# EAGLE schematic ngff-cardem (EAGLE 7.7.0)
DISCLAIMER: proprietary + confidential; VERSION: v2
Assembly variants: LEDs bott, LEDs top

## Sheet 1 of 3
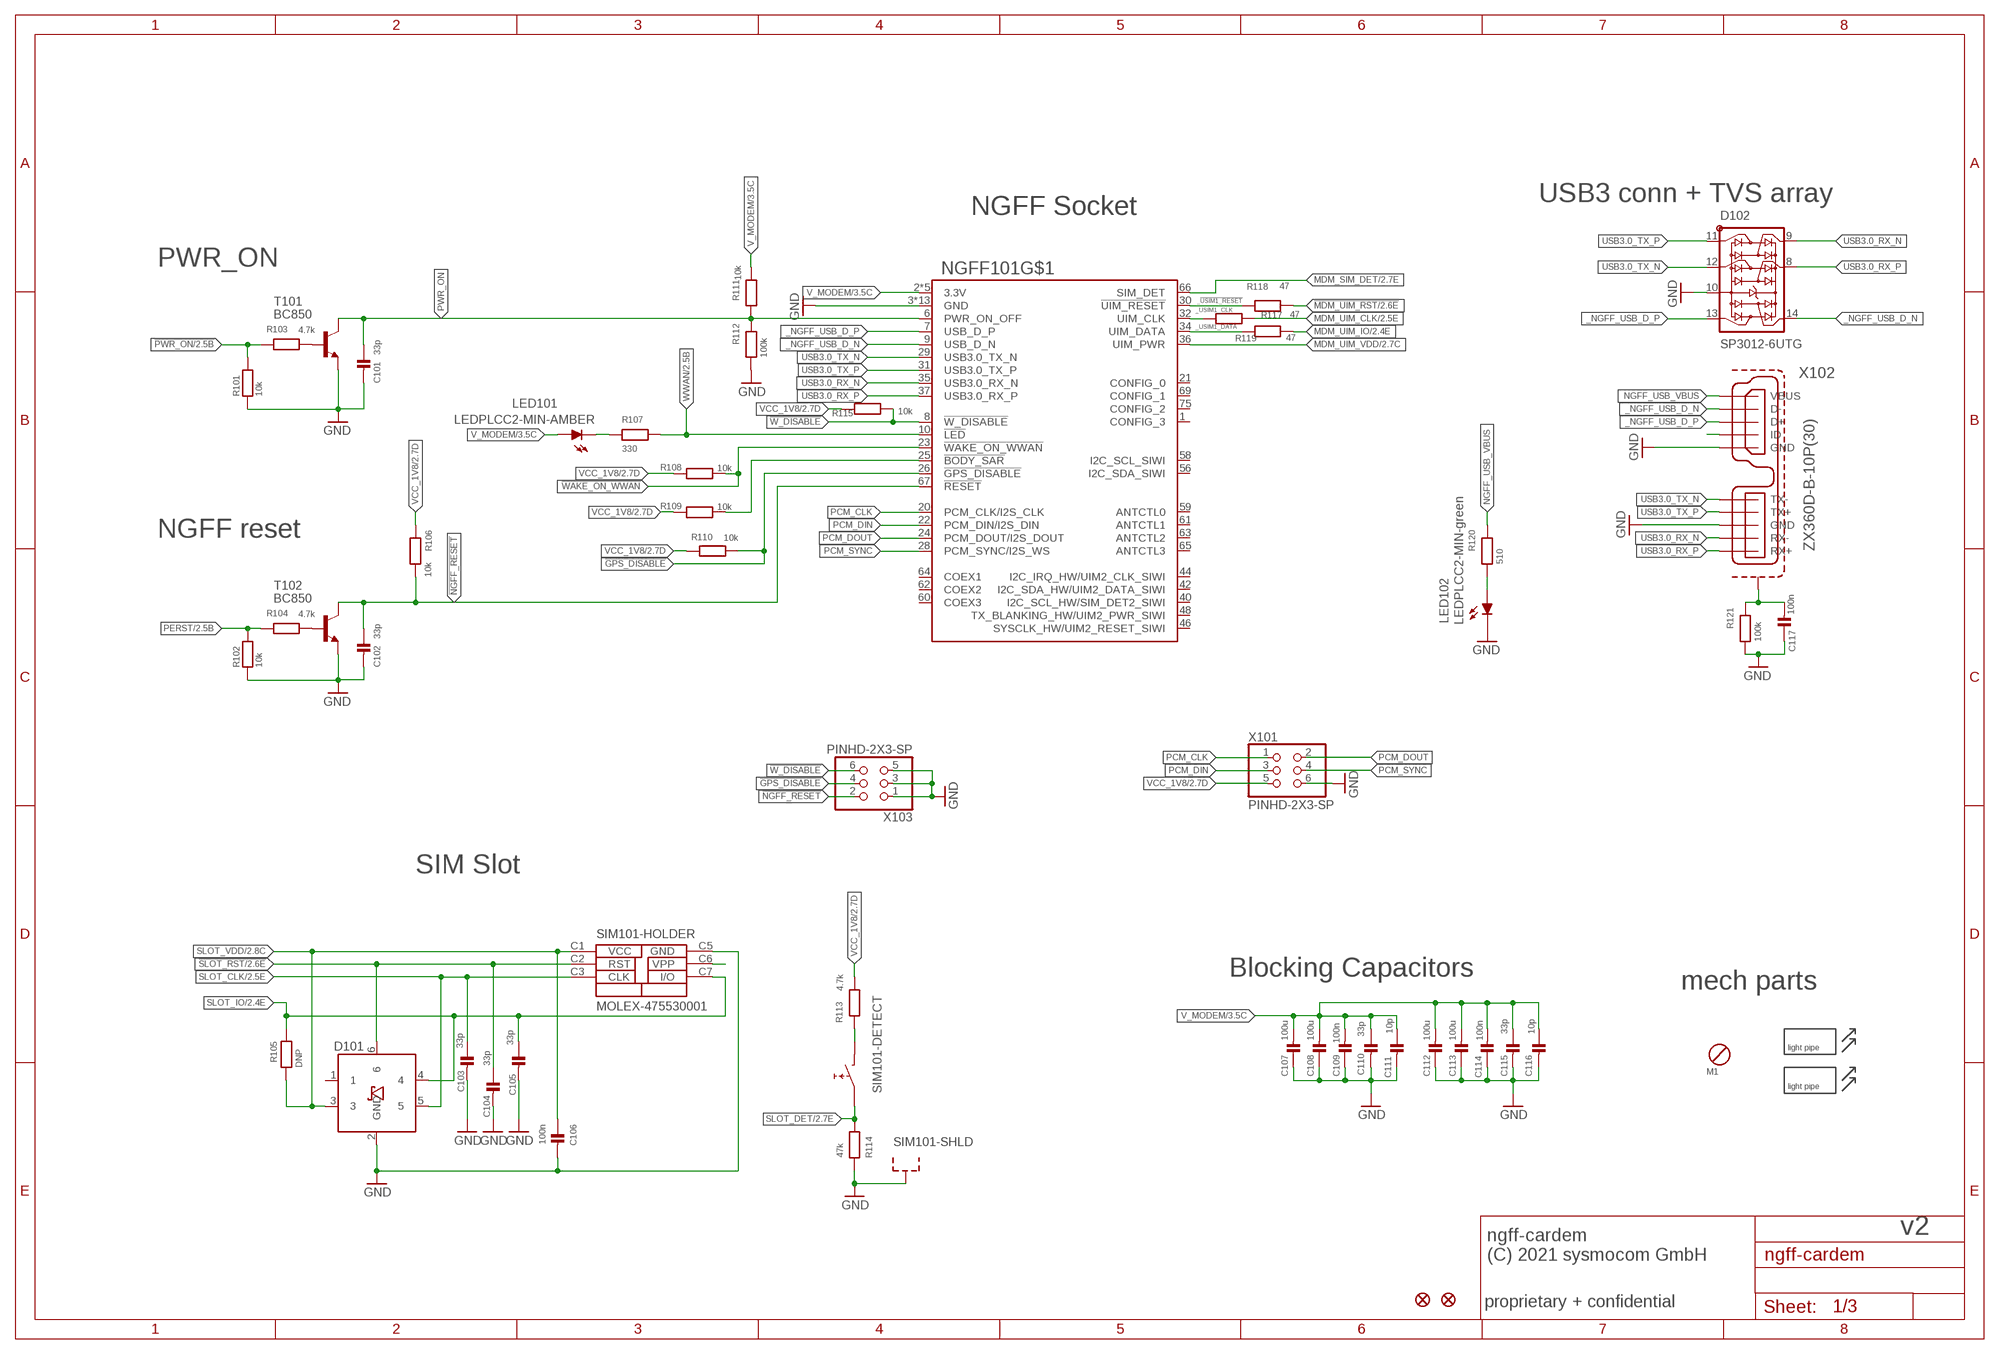
[diagram p0: schematic, sheet 1]
M1 (MECHPART): CLASS: UNKNOWN CLASS; DESCRIPTION: NO DESCRIPTION; LINK: https://www.digikey.de/product-detail/de/jae-electronics/SM3ZS067U410-NUT1-R1200/670-2865-1-ND; MANUFACTURER: UNKNOWN MANUFACTURER; MANUFACTURERPARTNUMBER: UNKNOWN MANUFACTURER PART NUMBER; POPULATED: TRUE; ROHSCERTIFICATE: UNKNOWN ROHS CERTIFICATE; SOURCE: UNKNOWN SOURCE; SOURCEPARTNUMBER: UNKNOWN SOURCE PART NUMBER

### Parts
C101  33p  CAP_CERAMIC_0402  [_0402]
C102  33p  CAP_CERAMIC_0402  [_0402]
C103  33p  CAP_CERAMIC_0402  [_0402]
C104  33p  CAP_CERAMIC_0402  [_0402]
C105  33p  CAP_CERAMIC_0402  [_0402]
C106  100n  CAP_CERAMIC_0603  [_0603]
C107  100u  CAP_CERAMIC1206  [1206]
C108  100u  CAP_CERAMIC1206  [1206]
C109  100n  CAP_CERAMIC_0603  [_0603]
C110  33p  CAP_CERAMIC_0402  [_0402]
C111  10p  CAP_CERAMIC_0603  [_0603]
C112  100u  CAP_CERAMIC1206  [1206]
C113  100u  CAP_CERAMIC1206  [1206]
C114  100n  CAP_CERAMIC_0603  [_0603]
C115  33p  CAP_CERAMIC_0402  [_0402]
C116  10p  CAP_CERAMIC_0603  [_0603]
C117  100n  CAP_CERAMIC_0603  [_0603]
D101  PESD5V0UBV  [SOT666]
D102  SP3012-6UTG  [UDFN-14]
JP102  FIDUCIALUFIDUCIAL  [MICRO-FIDUCIAL]
JP103  FIDUCIALUFIDUCIAL  [MICRO-FIDUCIAL]
LED101  LEDPLCC2-MIN-AMBER  LEDPLCC2-MIN  [PLCC2-MIN]  (not fitted in variant LEDs bott)
LED102  LEDPLCC2-MIN-green  LEDPLCC2-MIN  [PLCC2-MIN]  (not fitted in variant LEDs bott)
M2  MENTOR_12701001  [1270.1001]
M3  MENTOR_12701001  [1270.1001]
NGFF101  NGFF_B-NSOL  [NGFF_3042_3052_NSOL]
R101  10k  RESISTOR_0603  [_0603]
R102  10k  RESISTOR_0603  [_0603]
R103  4.7k  RESISTOR_0603  [_0603]
R104  4.7k  RESISTOR_0603  [_0603]
R105  DNP  RESISTOR_0603  [_0603]
R106  10k  RESISTOR_0603  [_0603]
R107  330  RESISTOR_0603  [_0603]
R108  10k  RESISTOR_0603  [_0603]
R109  10k  RESISTOR_0603  [_0603]
R110  10k  RESISTOR_0603  [_0603]
R111  10k  RESISTOR_0603  [_0603]
R112  100k  RESISTOR_0603  [_0603]
R113  4.7k  RESISTOR_0603  [_0603]
R114  47k  RESISTOR_0603  [_0603]
R115  10k  RESISTOR_0603  [_0603]
R117  47  RESISTOR_0402  [_0402]
R118  47  RESISTOR_0402  [_0402]
R119  47  RESISTOR_0402  [_0402]
R120  510  RESISTOR_0603  [_0603]
R121  100k  RESISTOR_0603  [_0603]
SIM101  MOLEX-475530001  [MOLEX-475530001]
T101  BC850  BC847C-NPN-SOT23-BEC  [SOT23-BEC]
T102  BC850  BC847C-NPN-SOT23-BEC  [SOT23-BEC]
X101  PINHD-2X3-SP  PINHD-2X3  [2X03]
X102  ZX360D-B-10P(30)  USB3.0-MICROB  [ZX360D-B]
X103  PINHD-2X3-SP  PINHD-2X3  [2X03]

### Nets
!BODY_SAR: NGFF101.25(!BODY_SAR) R109.1
!GPS_DISABLE: NGFF101.26(!GPS_DISABLE) R110.1 X103.4
!MDM_UIM_RST: R118.2 ; also sheet 2
!NGFF_RESET: C102.1 NGFF101.67(!RESET) R106.1 T102.C X103.2
!PWR_ON: R101.1 R103.2 ; also sheet 2
!SLOT_RST: C104.1 D101.6 SIM101.C2(-HOLDER:RST) ; also sheet 2
!W_DISABLE: NGFF101.8(!W_DISABLE) R115.1 X103.6
!WAKE_ON_WWAN: NGFF101.23(!WAKE_ON_WWAN) R108.1
_!USIM1_RESET: NGFF101.30(!UIM_RESET) R118.1
_NGFF_USB_D_N [usb]: D102.14 NGFF101.9(USB_D_N) X102.2(D-)
_NGFF_USB_D_P [usb]: D102.13 NGFF101.7(USB_D_P) X102.3(D+)
_USIM1_CLK: NGFF101.32(UIM_CLK) R117.1
_USIM1_DATA: NGFF101.34(UIM_DATA) R119.1
GND [supply-poly]: C101.2 C102.2 C103.2 C104.2 C105.2 C106.2 C107.1 C108.1 C109.1 C110.2 C111.2 C112.1 C113.1 C114.1 C115.2 C116.2 C117.1 D101.2(GND) D102.10(GND) LED102.K(C) NGFF101.3(GND) NGFF101.5(GND) NGFF101.11(GND) NGFF101.27(GND) NGFF101.33(GND) NGFF101.39(GND) NGFF101.45(GND) NGFF101.51(GND) NGFF101.57(GND) NGFF101.71(GND) NGFF101.73(GND) NGFF101.P$1(GND) NGFF101.P$2(GND) R101.2 R102.2 R112.1 R114.1 R121.1 SIM101.C5(-HOLDER:GND) SIM101.S1(-SHLD:SHLD) SIM101.S2(-SHLD:SHLD) T101.E T102.E X101.6 X102.5(GND) X102.8(GND) X103.1 X103.3 X103.5 ; also sheet 2,3
MDM_SIM_DET: NGFF101.66(SIM_DET) ; also sheet 2
MDM_UIM_CLK: R117.2 ; also sheet 2
MDM_UIM_IO: R119.2 ; also sheet 2
MDM_UIM_VDD: NGFF101.36(UIM_PWR) ; also sheet 2
N$3: R113.2 SIM101.CD2
N$10: C117.2 R121.2 X102.S1 X102.S2(S1) X102.S3(S1) X102.S4(S1) X102.S5(S1) X102.S6(S1) X102.S7(S1) X102.S8(S1)
N$11: R104.1 T102.B
N$14: R103.1 T101.B
N$17: X102.4(ID)
N$19: LED102.A R120.1
N$22: LED101.K(C) R107.1
N$62: SIM101.C6(-HOLDER:VPP)
NGFF_USB_VBUS [supply-poly]: R120.2 X102.1(VBUS)
PCM_CLK: NGFF101.20(PCM_CLK/I2S_CLK) X101.1
PCM_DIN: NGFF101.22(PCM_DIN/I2S_DIN) X101.3
PCM_DOUT: NGFF101.24(PCM_DOUT/I2S_DOUT) X101.2
PCM_SYNC: NGFF101.28(PCM_SYNC/I2S_WS) X101.4
PERST: R102.1 R104.2 ; also sheet 2
PWR_ON: C101.1 NGFF101.6(PWR_ON_OFF) R111.2 R112.2 T101.C
SLOT_CLK: C103.1 D101.5 SIM101.C3(-HOLDER:CLK) ; also sheet 2
SLOT_DET: R114.2 SIM101.CD1 ; also sheet 2
SLOT_IO: C105.1 D101.4 R105.2 SIM101.C7(-HOLDER:I/O) ; also sheet 2
SLOT_VDD [supply-poly]: C106.1 D101.3 R105.1 SIM101.C1(-HOLDER:VCC) ; also sheet 2
USB3.0_RX_N [usb]: D102.9 NGFF101.35(USB3.0_RX_N) X102.9(RX-)
USB3.0_RX_P [usb]: D102.8 NGFF101.37(USB3.0_RX_P) X102.10(RX+)
USB3.0_TX_N [usb]: D102.12 NGFF101.29(USB3.0_TX_N) X102.6(TX-)
USB3.0_TX_P [usb]: D102.11 NGFF101.31(USB3.0_TX_P) X102.7(TX+)
V_MODEM [supply]: C107.2 C108.2 C109.2 C110.1 C111.1 C112.2 C113.2 C114.2 C115.1 C116.1 LED101.A NGFF101.2(3.3V) NGFF101.4(3.3V) NGFF101.70(3.3V) NGFF101.72(3.3V) NGFF101.74(3.3V) R111.1 ; also sheet 3
VCC_1V8: R106.2 R108.2 R109.2 R110.2 R113.1 R115.2 X101.5 ; also sheet 2,3
WWAN: NGFF101.10(!LED) R107.2 ; also sheet 2
Unconnected: D101.1 NGFF101.1(CONFIG_3) NGFF101.21(CONFIG_0) NGFF101.40(I2C_SCL_HW/SIM_DET2_SIWI) NGFF101.41(PCIE_TX_N) NGFF101.42(I2C_SDA_HW/UIM2_DATA_SIWI) NGFF101.43(PCIE_TX_P) NGFF101.44(I2C_IRQ_HW/UIM2_CLK_SIWI) NGFF101.46(SYSCLK_HW/UIM2_RESET_SIWI) NGFF101.47(PCIE_RX_N) NGFF101.48(TX_BLANKING_HW/UIM2_PWR_SIWI) NGFF101.49(PCIE_RX_P) NGFF101.50(!PCIE_PERST) NGFF101.52(!PCIE_CLKREQ) NGFF101.53(PCIE_REFCLK_N) NGFF101.54(!PCIE_PEWAKE) NGFF101.55(PCIE_REFCLK_P) NGFF101.56(I2C_SDA_SIWI) NGFF101.58(I2C_SCL_SIWI) NGFF101.59(ANTCTL0) NGFF101.60(COEX3) NGFF101.61(ANTCTL1) NGFF101.62(COEX2) NGFF101.63(ANTCTL2) NGFF101.64(COEX1) NGFF101.65(ANTCTL3) NGFF101.69(CONFIG_1) NGFF101.75(CONFIG_2)

### Notes on the sheet
- USB3 conn + TVS array
- NGFF Socket
- PWR_ON
- NGFF reset
- SIM Slot
- Blocking Capacitors
- mech parts
- ngff-cardem
  (C) 2021 sysmocom GmbH

## Sheet 2 of 3
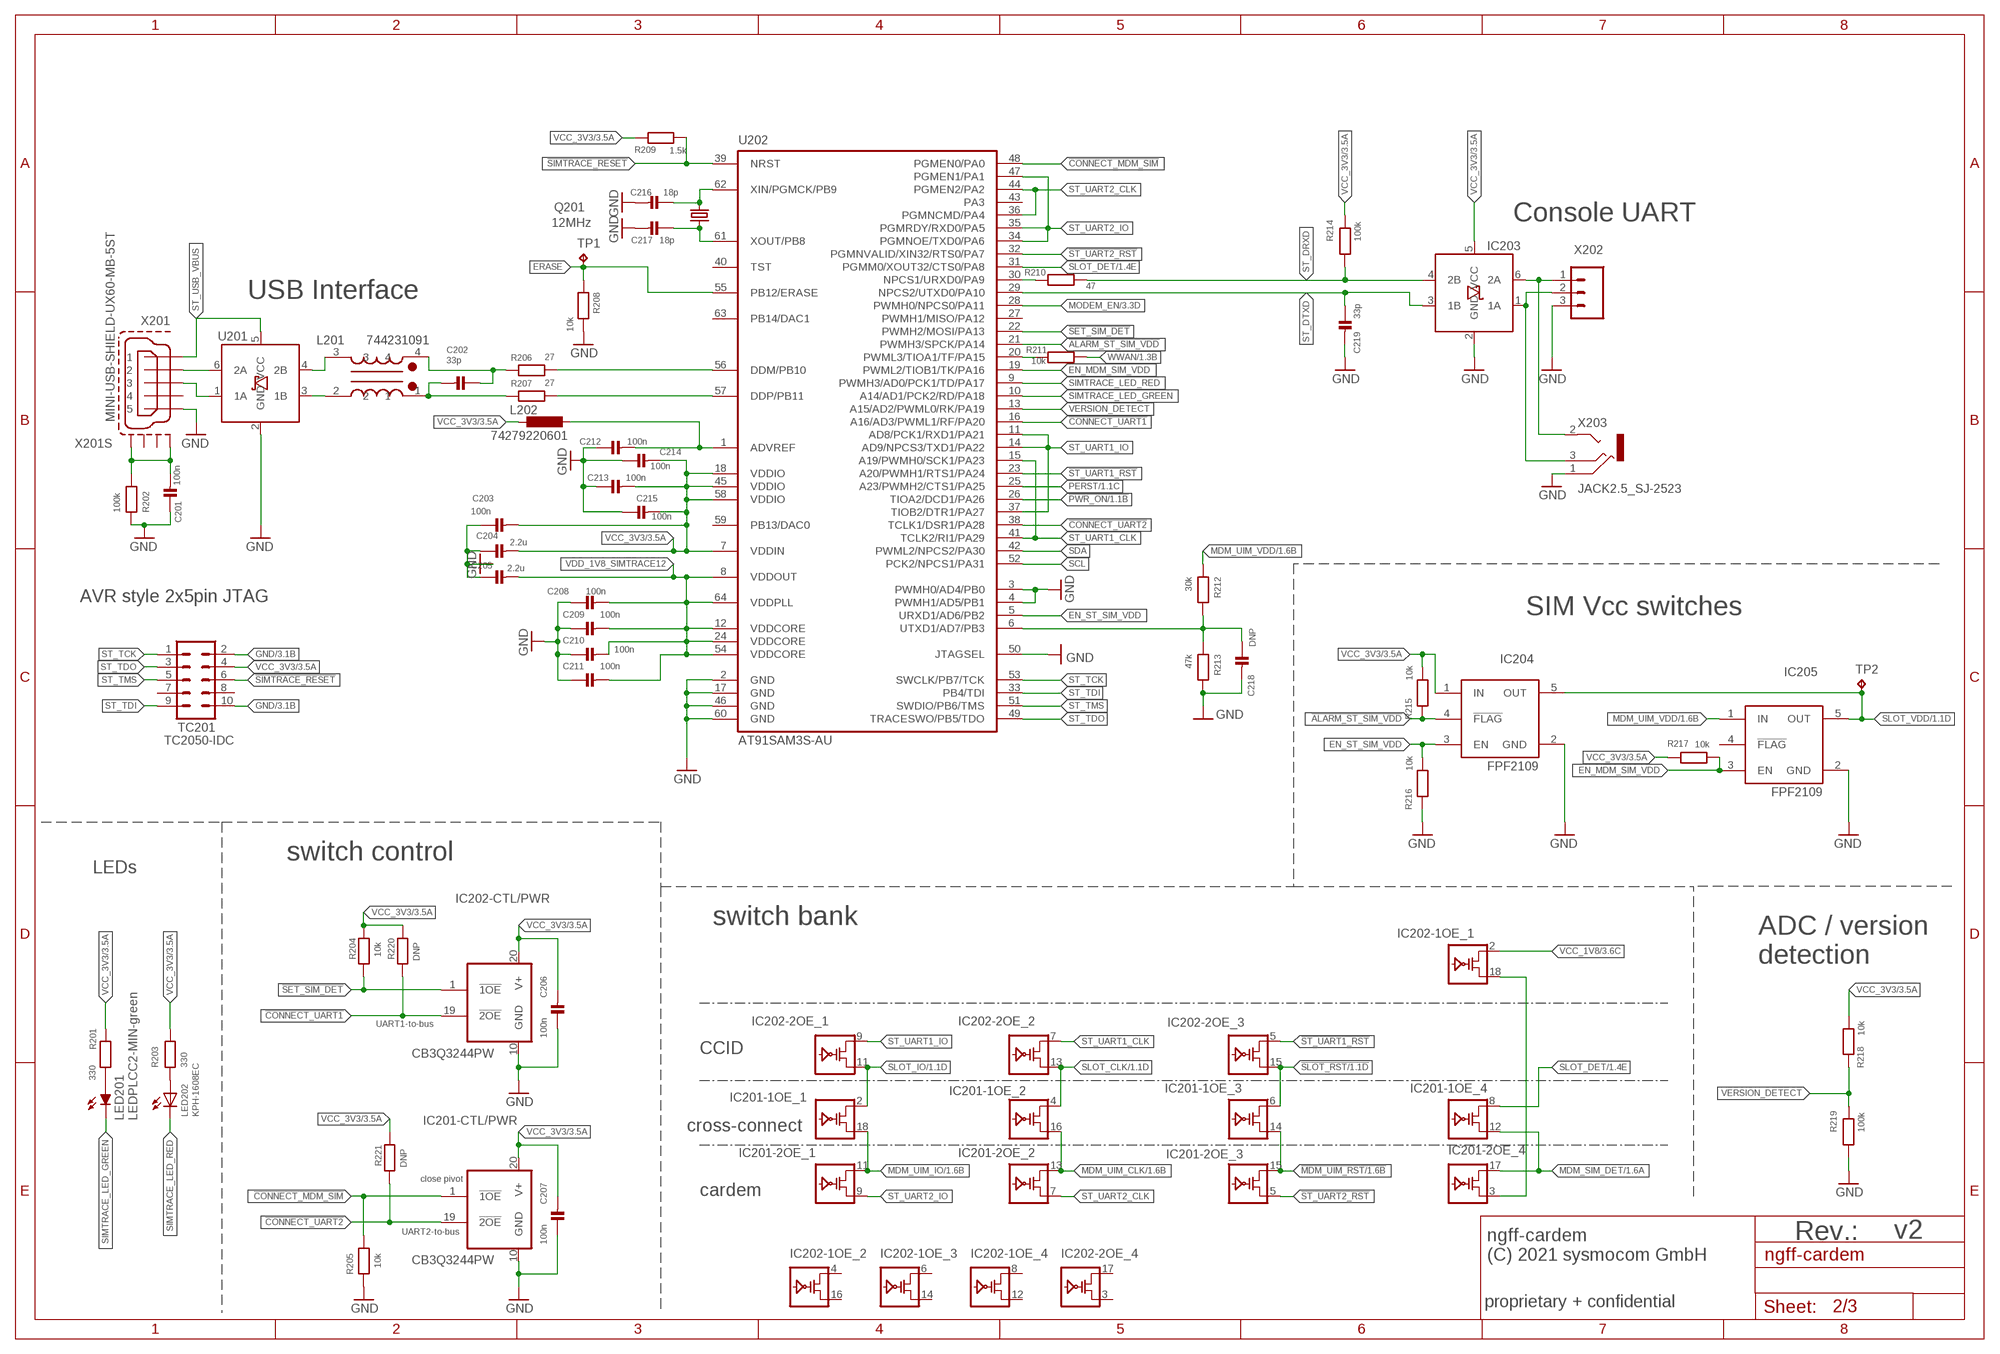
[diagram p1: schematic, sheet 2]

### Parts
C201  100n  CAP_CERAMIC_0603  [_0603]
C202  33p  CAP_CERAMIC_0402  [_0402]
C203  100n  CAP_CERAMIC_0402  [_0402]
C204  2.2u  CAP_CERAMIC_0603  [_0603]
C205  2.2u  CAP_CERAMIC_0603  [_0603]
C206  100n  CAP_CERAMIC_0402  [_0402]
C207  100n  CAP_CERAMIC_0402  [_0402]
C208  100n  CAP_CERAMIC_0402  [_0402]
C209  100n  CAP_CERAMIC_0402  [_0402]
C210  100n  CAP_CERAMIC_0402  [_0402]
C211  100n  CAP_CERAMIC_0402  [_0402]
C212  100n  CAP_CERAMIC_0402  [_0402]
C213  100n  CAP_CERAMIC_0402  [_0402]
C214  100n  CAP_CERAMIC_0402  [_0402]
C215  100n  CAP_CERAMIC_0402  [_0402]
C216  18p  CAP_CERAMIC_0603  [_0603]
C217  18p  CAP_CERAMIC_0603  [_0603]
C218  DNP  CAP_CERAMIC_0603  [_0603]
C219  33p  CAP_CERAMIC_0402  [_0402]
IC201  CB3Q3244PW  [TSSOP20]
IC202  CB3Q3244PW  [TSSOP20]
IC203  IP4234CZ6  [TSOP-6]
IC204  FPF2109  FPF21XX  [SOT23-5]
IC205  FPF2109  FPF21XX  [SOT23-5]
L201  744231091  WE-CNSW_0805  [WE-CNSW_0805]
L202  74279220601  INDUCTOR_0805  [_0805]
LED201  LEDPLCC2-MIN-green  LEDPLCC2-MIN  [PLCC2-MIN]  (not fitted in variant LEDs bott)
LED202  KPH-1608EC  LEDCHIP-LED0603  [CHIP-LED0603]
Q201  12MHz  CRYSTALHC49UP  [HC49UP]
R201  330  RESISTOR_0603  [_0603]
R202  100k  RESISTOR_0603  [_0603]
R203  330  RESISTOR_0603  [_0603]
R204  10k  RESISTOR_0603  [_0603]
R205  10k  RESISTOR_0603  [_0603]
R206  27  RESISTOR_0603  [_0603]
R207  27  RESISTOR_0603  [_0603]
R208  10k  RESISTOR_0603  [_0603]
R209  1.5k  RESISTOR_0603  [_0603]
R210  47  RESISTOR_0402  [_0402]
R211  10k  RESISTOR_0603  [_0603]
R212  30k  RESISTOR_0603  [_0603]
R213  47k  RESISTOR_0603  [_0603]
R214  100k  RESISTOR_0603  [_0603]
R215  10k  RESISTOR_0603  [_0603]
R216  10k  RESISTOR_0603  [_0603]
R217  10k  RESISTOR_0603  [_0603]
R218  10k  RESISTOR_0603  [_0603]
R219  100k  RESISTOR_0603  [_0603]
R220  DNP  RESISTOR_0603  [_0603]
R221  DNP  RESISTOR_0603  [_0603]
TC201  TC2050-IDC  [TC2050-IDC]
TP1  TPTP14R  [TP14R]
TP2  TPTP14R  [TP14R]
U201  IP4234CZ6  [TSOP-6]
U202  AT91SAM3S-AU  [LQFP64]
X201  MINI-USB-SHIELD-UX60-MB-5ST  [UX60-MB-5ST]
X202  2.54mm  PINHD-1X3LOCK  [1X03_LOCK]
X203  JACK2.5_SJ-2523  [JACK2.5_SJ-2523]

### Nets
!ALARM_ST_SIM_VDD: IC204.4(!FLAG) R215.2 U202.21(PWMH3/SPCK/PA14)
!CONNECT_MDM_SIM: IC201.1(-CTL/PWR:!1OE) R205.1 U202.48(PGMEN0/PA0)
!CONNECT_UART1: IC202.19(-CTL/PWR:!2OE) R220.2 U202.16(A16/AD3/PWML1/RF/PA20)
!CONNECT_UART2: IC201.19(-CTL/PWR:!2OE) R221.2 U202.38(TCLK1/DSR1/PA28)
!MDM_UIM_RST: IC201.14(-1OE_3:B) IC201.15(-2OE_3:A) ; also sheet 1
!PWR_ON: U202.26(TIOA2/DCD1/PA26) ; also sheet 1
!SET_SIM_DET: IC202.1(-CTL/PWR:!1OE) R204.2 U202.22(PWMH2/MOSI/PA13)
!SIMTRACE_RESET: R209.1 TC201.6 U202.39(NRST)
!SLOT_RST: IC201.6(-1OE_3:A) IC202.15(-2OE_3:A) ; also sheet 1
!ST_UART1_RST: IC202.5(-2OE_3:B) U202.23(A20/PWMH1/RTS1/PA24)
!ST_UART2_RST: IC201.5(-2OE_3:B) U202.32(PGMNVALID/XIN32/RTS0/PA7)
_SIMTRACE12_USB_D_N [usb]: R206.2 U202.56(DDM/PB10)
_SIMTRACE12_USB_D_P [usb]: R207.2 U202.57(DDP/PB11)
_USB_D_N1 [usb]: U201.6(2A) X201.2
_USB_D_P1 [usb]: U201.1(1A) X201.3
EN_MDM_SIM_VDD: IC205.3(EN) R217.1 U202.19(PWML2/TIOB1/TK/PA16)
EN_ST_SIM_VDD: IC204.3(EN) R216.1 U202.5(URXD1/AD6/PB2)
ERASE: R208.2 TP1.TP U202.55(PB12/ERASE)
GND [supply-poly]: C201.1 C203.1 C204.1 C205.1 C206.1 C207.1 C208.1 C209.1 C210.1 C211.1 C212.1 C213.1 C214.1 C215.1 C216.2 C217.2 C218.2 C219.2 IC201.10(-CTL/PWR:GND) IC202.10(-CTL/PWR:GND) IC203.2(GND) IC204.2(GND) IC205.2(GND) R202.2 R205.2 R208.1 R213.1 R216.2 R219.1 TC201.2 TC201.10 U201.2(GND) U202.2(GND) U202.3(PWMH0/AD4/PB0) U202.4(PWMH1/AD5/PB1) U202.17(GND) U202.46(GND) U202.50(JTAGSEL) U202.60(GND) X201.5 X202.3 X203.1(RING) ; also sheet 1,3
MDM_SIM_DET: IC201.12(-1OE_4:B) IC201.17(-2OE_4:A) ; also sheet 1
MDM_UIM_CLK: IC201.13(-2OE_2:A) IC201.16(-1OE_2:B) ; also sheet 1
MDM_UIM_IO: IC201.11(-2OE_1:A) IC201.18(-1OE_1:B) ; also sheet 1
MDM_UIM_VDD: IC205.1(IN) R212.2 ; also sheet 1
MODEM_EN: U202.28(PWMH0/NPCS0/PA11) ; also sheet 3
N$1: L201.2 U201.3(1B)
N$2: L201.3 U201.4(2B)
N$4: LED202.A R203.2
N$5: IC201.3(-2OE_4:B) IC202.18(-1OE_1:B)
N$8: R210.1 U202.30(NPCS1/URXD0/PA9)
N$9: C201.2 R202.1 X201.M1(S1) X201.M4(S4)
N$12: LED201.A R201.1
N$15: C216.1 Q201.2 U202.62(XIN/PGMCK/PB9)
N$16: C217.1 Q201.1 U202.61(XOUT/PB8)
N$18: C218.1 R212.1 R213.2 U202.6(UTXD1/AD7/PB3)
N$45: R211.2 U202.20(PWML3/TIOA1/TF/PA15)
N$68: IC203.6(2A) X202.1 X203.2(TIP)
N$69: C212.2 L202.2 U202.1(ADVREF)
PERST: U202.25(A23/PWMH2/CTS1/PA25) ; also sheet 1
SCL: U202.52(PCK2/NPCS1/PA31)
SDA: U202.42(PWML2/NPCS2/PA30)
SIMTRACE12_USB_D_N [usb]: C202.1 L201.4 R206.1
SIMTRACE12_USB_D_P [usb]: C202.2 L201.1 R207.1
SIMTRACE_LED_GREEN: LED201.K(C) U202.10(A14/AD1/PCK2/RD/PA18)
SIMTRACE_LED_RED: LED202.C U202.9(PWMH3/AD0/PCK1/TD/PA17)
SLOT_CLK: IC201.4(-1OE_2:A) IC202.13(-2OE_2:A) ; also sheet 1
SLOT_DET: IC201.8(-1OE_4:A) U202.31(PGMM0/XOUT32/CTS0/PA8) ; also sheet 1
SLOT_IO: IC201.2(-1OE_1:A) IC202.11(-2OE_1:A) ; also sheet 1
SLOT_VDD [supply-poly]: IC204.5(OUT) IC205.5(OUT) TP2.TP ; also sheet 1
ST_DRXD: IC203.4(2B) R210.2 R214.1
ST_DTXD: C219.1 IC203.3(1B) U202.29(NPCS2/UTXD0/PA10)
ST_TCK: TC201.1 U202.53(SWCLK/PB7/TCK)
ST_TDI: TC201.9 U202.33(PB4/TDI)
ST_TDO: TC201.3 U202.49(TRACESWO/PB5/TDO)
ST_TMS: TC201.5 U202.51(SWDIO/PB6/TMS)
ST_UART1_CLK: IC202.7(-2OE_2:B) U202.15(A19/PWMH0/SCK1/PA23) U202.41(TCLK2/RI1/PA29)
ST_UART1_IO: IC202.9(-2OE_1:B) U202.11(AD8/PCK1/RXD1/PA21) U202.14(AD9/NPCS3/TXD1/PA22) U202.37(TIOB2/DTR1/PA27)
ST_UART2_CLK: IC201.7(-2OE_2:B) U202.36(PGMNCMD/PA4) U202.44(PGMEN2/PA2)
ST_UART2_IO: IC201.9(-2OE_1:B) U202.34(PGMNOE/TXD0/PA6) U202.35(PGMRDY/RXD0/PA5) U202.47(PGMEN1/PA1)
ST_USB_VBUS [supply-poly]: U201.5(VCC) X201.1
UART_TX0: IC203.1(1A) X202.2 X203.3(MIDDLE)
VCC_1V8: IC202.2(-1OE_1:A) ; also sheet 1,3
VCC_3V3 [supply]: C203.2 C204.2 C206.2 C207.2 C213.2 C214.2 C215.2 IC201.20(-CTL/PWR:V+) IC202.20(-CTL/PWR:V+) IC203.5(VCC) IC204.1(IN) L202.1 R201.2 R203.1 R204.1 R209.2 R214.2 R215.1 R217.2 R218.1 R220.1 R221.1 TC201.4 U202.7(VDDIN) U202.18(VDDIO) U202.45(VDDIO) U202.58(VDDIO) ; also sheet 3
VDD_1V8_SIMTRACE12 [supply-poly]: C205.2 C208.2 C209.2 C210.2 C211.2 U202.8(VDDOUT) U202.12(VDDCORE) U202.24(VDDCORE) U202.54(VDDCORE) U202.64(VDDPLL)
VERSION_DETECT: R218.2 R219.2 U202.13(A15/AD2/PWML0/RK/PA19)
WWAN: R211.1 ; also sheet 1
Unconnected: IC202.3(-2OE_4:B) IC202.4(-1OE_2:A) IC202.6(-1OE_3:A) IC202.8(-1OE_4:A) IC202.12(-1OE_4:B) IC202.14(-1OE_3:B) IC202.16(-1OE_2:B) IC202.17(-2OE_4:A) IC205.4(!FLAG) TC201.7 TC201.8 U202.27(PWMH1/MISO/PA12) U202.40(TST) U202.43(PA3) U202.59(PB13/DAC0) U202.63(PB14/DAC1) X201.4 X201.M2(S2) X201.M3(S3)

### Notes on the sheet
- Console UART
- USB Interface
- AVR style 2x5pin JTAG
- SIM Vcc switches
- switch control
- LEDs
- switch bank
- ADC / version 
  detection
- UART1-to-bus
- CCID
- cross-connect
- close pivot
- cardem
- UART2-to-bus
- Rev.:
- ngff-cardem
  (C) 2021 sysmocom GmbH

## Sheet 3 of 3
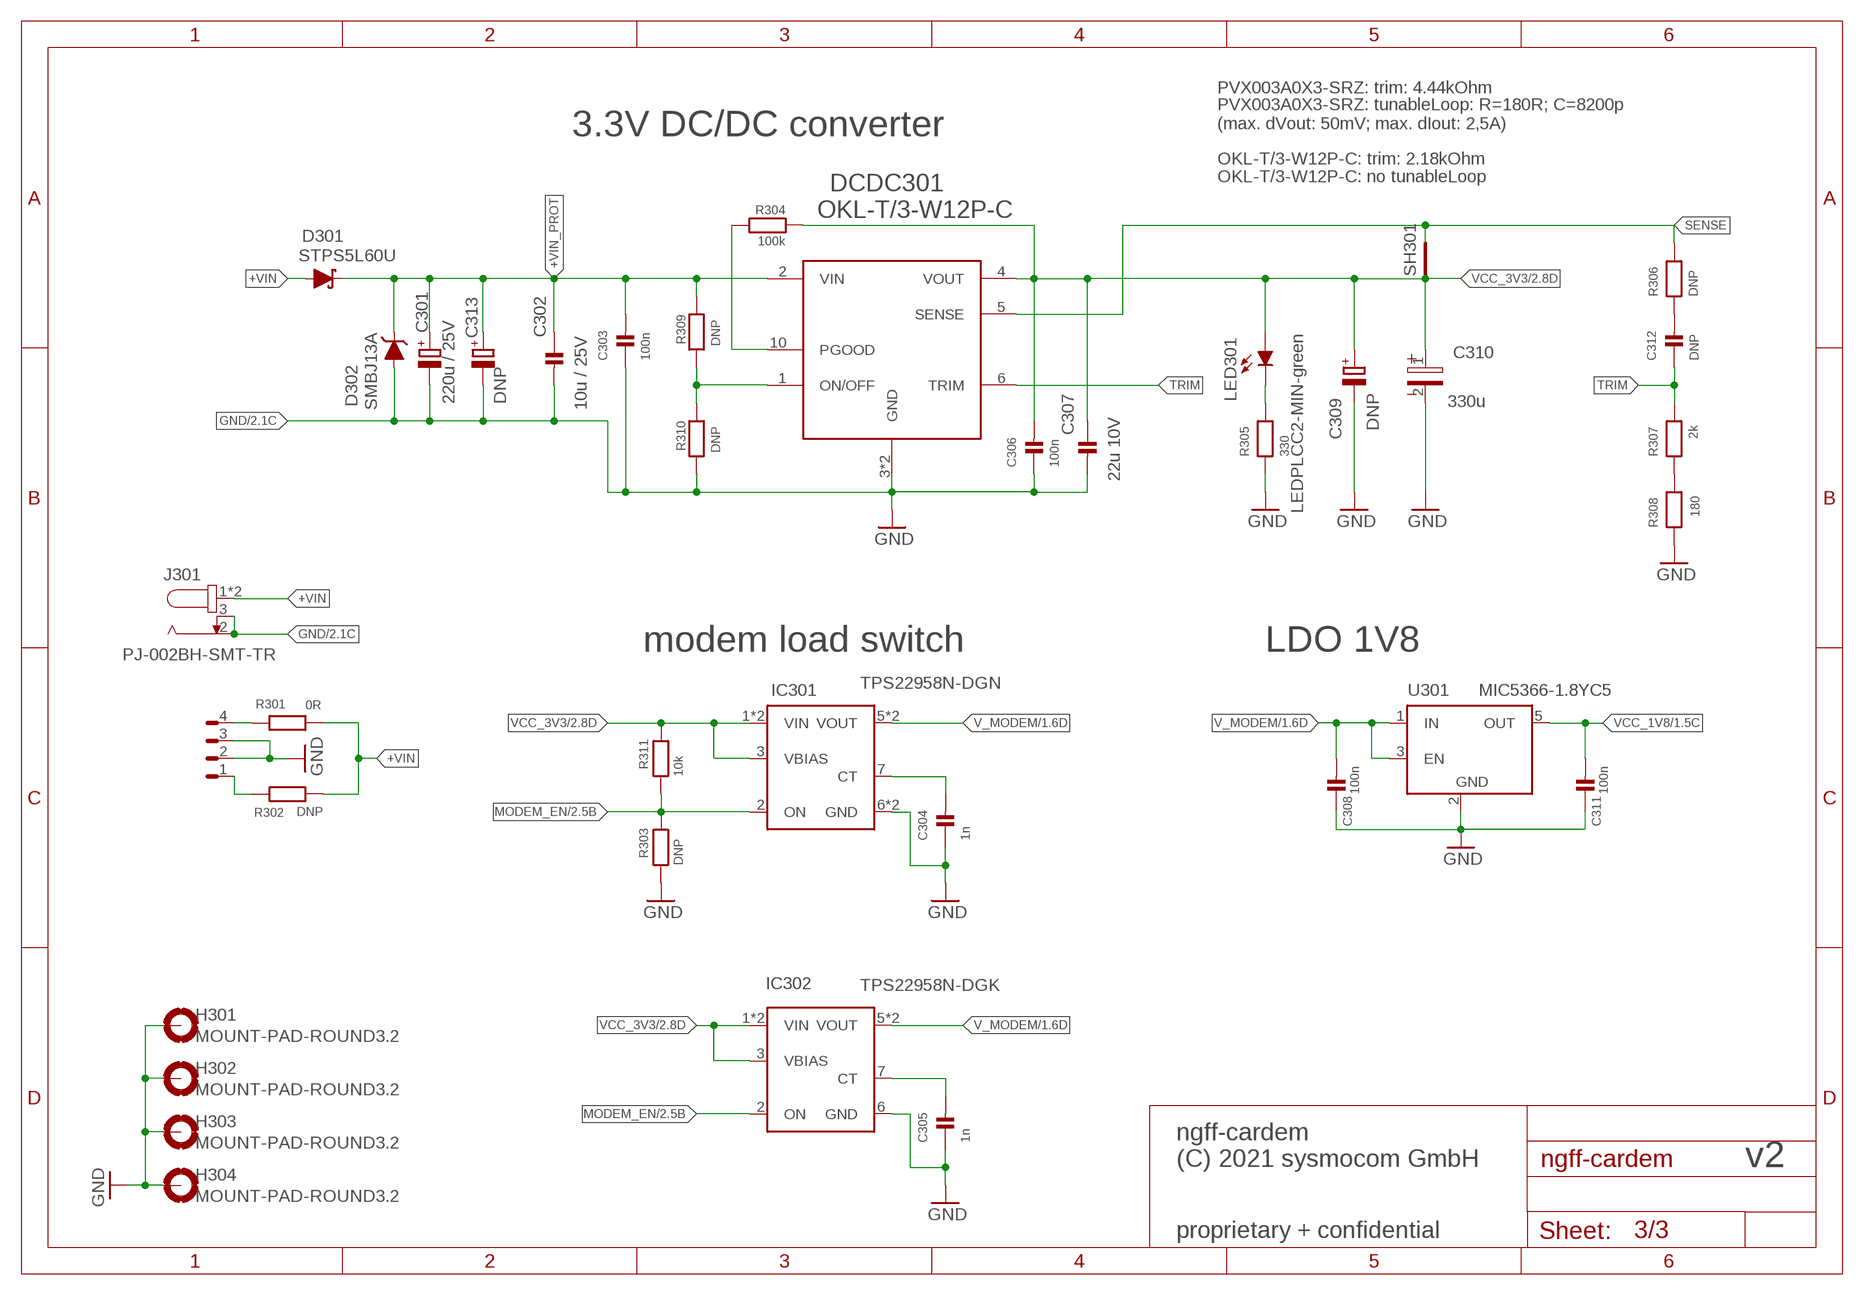
[diagram p2: schematic, sheet 3]

### Parts
C301  220u / 25V  CPOL-EUUD-8X10  [UD-8X10_NICHICON]
C302  10u / 25V  CAP_CERAMIC-C1812  [C1812K]
C303  100n  CAP_CERAMIC_0603  [_0603]
C304  1n  CAP_CERAMIC_0603  [_0603]
C305  1n  CAP_CERAMIC_0603  [_0603]
C306  100n  CAP_CERAMIC_0603  [_0603]
C307  22u 10V  CAP_CERAMIC1206  [1206]
C308  100n  CAP_CERAMIC_0603  [_0603]
C309  DNP  CPOL-EUSMCB  [SMC_B]
C310  330u  WCAP-PSLC_8X11.7(DXL)  [4.2X1.9X2.8(BXCXA)]
C311  100n  CAP_CERAMIC_0603  [_0603]
C312  DNP  CAP_CERAMIC_0603  [_0603]
C313  DNP  CPOL-EUUD-8X10  [UD-8X10_NICHICON]
D301  STPS5L60U  DIODE-SCHOTTKY-SMB  [SMBDIODE]
D302  SMBJ13A  DIODE-TVS-SMB  [SMBDIODE]
DCDC301  OKL-T/3-W12P-C  DCDC-GE-PVX-ALL  [DC-DC_CON-ALLPADS]
H301  MOUNT-PAD-ROUND3.2  [3,2-PAD]
H302  MOUNT-PAD-ROUND3.2  [3,2-PAD]
H303  MOUNT-PAD-ROUND3.2  [3,2-PAD]
H304  MOUNT-PAD-ROUND3.2  [3,2-PAD]
IC301  TPS22958N-DGN  [HVSSOP8]
IC302  TPS22958N-DGK  [VSSOP8]
J301  PJ-002BH-SMT-TR  694108106102  [694108106102]
LED301  LEDPLCC2-MIN-green  LEDPLCC2-MIN  [PLCC2-MIN]  (not fitted in variant LEDs bott)
R301  0R  RESISTOR1210  [1210]
R302  DNP  RESISTOR1210  [1210]
R303  DNP  RESISTOR_0603  [_0603]
R304  100k  RESISTOR_0603  [_0603]
R305  330  RESISTOR_0603  [_0603]
R306  DNP  RESISTOR_0603  [_0603]
R307  2k  RESISTOR_0603  [_0603]
R308  180  RESISTOR_0603  [_0603]
R309  DNP  RESISTOR_0603  [_0603]
R310  DNP  RESISTOR_0603  [_0603]
R311  10k  RESISTOR_0603  [_0603]
SH301  SHORT-HT5  [SHORT_TOP-50]
U301  MIC5366-1.8YC5  LDO_FIXED_EN-MIC5365-YC5  [SC70-5]
X301  171826-4-RA  [171826-4]

### Nets
+VIN [supply-poly]: D301.A J301.1 J301.1-1 R301.2 R302.1
+VIN_PROT [supply-poly]: C301.+ C302.1 C303.2 C313.+ D301.C D302.C DCDC301.2(VIN) R309.1
GND [supply-poly]: C301.- C302.2 C303.1 C304.1 C305.1 C306.1 C307.2 C308.1 C309.- C310.2 C311.1 C313.- D302.A DCDC301.3(GND) DCDC301.7(GND) H301.B3,2(MOUNT) H302.B3,2(MOUNT) H303.B3,2(MOUNT) H304.B3,2(MOUNT) IC301.6(GND) IC301.EXP(GND) IC302.6(GND) J301.2 J301.3 R303.1 R305.1 R308.2 R310.2 U301.2(GND) X301.2 X301.3 ; also sheet 1,2
MODEM_EN: IC301.2(ON) IC302.2(ON) R303.2 R311.1 ; also sheet 2
N$6: C312.2 R306.2
N$7: LED301.K(C) R305.2
N$13: DCDC301.10(PGOOD) R304.2
N$20: C305.2 IC302.7(CT)
N$23: R301.1 X301.4
N$24: R302.2 X301.1
N$25 [supply-poly]: DCDC301.1(ON/OFF) R309.2 R310.1
N$59: R307.2 R308.1
N$91: C304.2 IC301.7(CT)
SENSE: DCDC301.5(SENSE) R306.1 SH301.2
TRIM: C312.1 DCDC301.6(TRIM) R307.1
V_MODEM [supply]: C308.2 IC301.5(VOUT) IC301.8(VOUT) IC302.5(VOUT) IC302.8(VOUT) U301.1(IN) U301.3(EN) ; also sheet 1
VCC_1V8: C311.2 U301.5(OUT) ; also sheet 1,2
VCC_3V3 [supply]: C306.2 C307.1 C309.+ C310.1 DCDC301.4(VOUT) IC301.1(VIN) IC301.3(VBIAS) IC301.4(VIN) IC302.1(VIN) IC302.3(VBIAS) IC302.4(VIN) LED301.A R304.1 R311.2 SH301.1 ; also sheet 2

### Notes on the sheet
- PVX003A0X3-SRZ: trim: 4.44kOhm
- PVX003A0X3-SRZ: tunableLoop: R=180R; C=8200p 
  (max. dVout: 50mV; max. dIout: 2,5A)
- 3.3V DC/DC converter
- OKL-T/3-W12P-C: trim: 2.18kOhm
- OKL-T/3-W12P-C: no tunableLoop
- modem load switch | LDO 1V8
- ngff-cardem
  (C) 2021 sysmocom GmbH

## Library data of the parts
C101-C105 C110 C115 C202 C219 = rc-sysmocom:CAP_CERAMIC: Ceramic Capacitors 0402 - 0402 Surface Mount Capacitors 16pF 50V 5% [Digikey: 445-4899-2-ND] 18pF 50V 5% [Digikey: 490-1281-2-ND] 22pF 50V 5% [Digikey: 490-1283-2-ND] 68pF 50V 5% [Digikey: 490-1289-2-ND] 0.1uF 10V 10% [Digikey: 490-1318-2-ND] 1.0uF 6.3V 10% [Digikey: 490-1320-2-ND] 0603 - 0603 Surface Mount Capacitors 16 pF 50V 5% [Digikey: 445-5051-2-ND] 22 pF 50V [Digikey: PCC220ACVTR-ND] 33 pF 50V 5% [Digikey: 490-1415-1-ND] 56pF 50V 5% [Digikey: 490-1421-1-ND] 220pF 50V 5% [Digikey: 445-1285-1-ND] 680 pF 50V 2200 pF 50V 5% C0G [Digikey: 445-1297-1-ND] 5600 pF 100V 5% X7R [Digikey: 478-3711-1-ND] 0.1 µF 25V 10% [Digikey: PCC2277TR-ND] 0.22 µF 16V 10% X7R [Digikey: 445-1318-1-ND] 1.0 µF 25V 10% [Digikey: 445-5146-2-ND] 0603 - RF Specific 3pF 250V +/-0.1pF RF [Digikey: 712-1347-1-ND] 18 pF 250V 5% [Digikey: 478-3505-1-ND or 712-1322-1-ND] 56 pF 250V 5% C0G RF [Digikey: 490-4867-1-ND] 68 pF 250V RF [Digikey: 490-4868-1-ND] 0805 - 0805 Surface Mount Capacitors 220 pF 250V 2% RF Ceramic Capacitor [Digikey: 712-1398-1-ND] 1000 pF 50V 2% NP0 Ceramic Capacitor [Digikey: 478-3760-1-ND] 0.1 µF 25V 10% Ceramic Capacitor [Digikey: PCC1828TR-ND] 1.0 µF 16V 10% Ceramic Capacitor[Digikey: 490-1691-2-ND] 10.0 µF 10V 10% Ceramic Capacitor[Digikey: 709-1228-1-ND] 10.0 uF 16V 10% Ceramic Capacitor [Digikey: 478-5165-2-ND] 47 uF 6.3V 20% Ceramic Capacitor [Digikey: 587-1779-1-ND or 399-5506-1-ND] 1206 - 1206 Surface Mount Capacitors 47uF 10V 20% Ceramic Capacitor [Digikey: 490-5528-1-ND or 399-5508-1-ND or 445-6010-1-ND] 100uF 6.3V -20%, +80% Y5V Ceramic Capacitor (Digikey: 490-4512-1-ND, Mouser: 81-GRM31CF50J107ZE1L) 1810 - 1810 Surface Mount Capacitors High volt MLC; no solder stop between for higher isolation; CLASS: CAPACITOR; DESCRIPTION: CAP CER 33PF 50V NP0 0402; LINK: http://www.digikey.de/product-detail/de/CL05C330JB5NNNC/1276-1272-1-ND/3889358; MANUFACTURER: Samsung Electro-Mechanics America, Inc.; MANUFACTURERPARTNUMBER: CL05C330JB5NNNC; POPULATED: TRUE; ROHSCERTIFICATE: Bleifrei / RoHS-konform; SOURCE: DIGIKEY; SOURCEPARTNUMBER: 1276-1272-1-ND
C106 C109 C114 C117 C201 C303 C306 C308 C311 = rc-sysmocom:CAP_CERAMIC: Ceramic Capacitors 0402 - 0402 Surface Mount Capacitors 16pF 50V 5% [Digikey: 445-4899-2-ND] 18pF 50V 5% [Digikey: 490-1281-2-ND] 22pF 50V 5% [Digikey: 490-1283-2-ND] 68pF 50V 5% [Digikey: 490-1289-2-ND] 0.1uF 10V 10% [Digikey: 490-1318-2-ND] 1.0uF 6.3V 10% [Digikey: 490-1320-2-ND] 0603 - 0603 Surface Mount Capacitors 16 pF 50V 5% [Digikey: 445-5051-2-ND] 22 pF 50V [Digikey: PCC220ACVTR-ND] 33 pF 50V 5% [Digikey: 490-1415-1-ND] 56pF 50V 5% [Digikey: 490-1421-1-ND] 220pF 50V 5% [Digikey: 445-1285-1-ND] 680 pF 50V 2200 pF 50V 5% C0G [Digikey: 445-1297-1-ND] 5600 pF 100V 5% X7R [Digikey: 478-3711-1-ND] 0.1 µF 25V 10% [Digikey: PCC2277TR-ND] 0.22 µF 16V 10% X7R [Digikey: 445-1318-1-ND] 1.0 µF 25V 10% [Digikey: 445-5146-2-ND] 0603 - RF Specific 3pF 250V +/-0.1pF RF [Digikey: 712-1347-1-ND] 18 pF 250V 5% [Digikey: 478-3505-1-ND or 712-1322-1-ND] 56 pF 250V 5% C0G RF [Digikey: 490-4867-1-ND] 68 pF 250V RF [Digikey: 490-4868-1-ND] 0805 - 0805 Surface Mount Capacitors 220 pF 250V 2% RF Ceramic Capacitor [Digikey: 712-1398-1-ND] 1000 pF 50V 2% NP0 Ceramic Capacitor [Digikey: 478-3760-1-ND] 0.1 µF 25V 10% Ceramic Capacitor [Digikey: PCC1828TR-ND] 1.0 µF 16V 10% Ceramic Capacitor[Digikey: 490-1691-2-ND] 10.0 µF 10V 10% Ceramic Capacitor[Digikey: 709-1228-1-ND] 10.0 uF 16V 10% Ceramic Capacitor [Digikey: 478-5165-2-ND] 47 uF 6.3V 20% Ceramic Capacitor [Digikey: 587-1779-1-ND or 399-5506-1-ND] 1206 - 1206 Surface Mount Capacitors 47uF 10V 20% Ceramic Capacitor [Digikey: 490-5528-1-ND or 399-5508-1-ND or 445-6010-1-ND] 100uF 6.3V -20%, +80% Y5V Ceramic Capacitor (Digikey: 490-4512-1-ND, Mouser: 81-GRM31CF50J107ZE1L) 1810 - 1810 Surface Mount Capacitors High volt MLC; no solder stop between for higher isolation; CLASS: CAPACITOR; DESCRIPTION: CAP CER 0.1UF 16V X7R 0603; LINK: https://www.digikey.de/product-detail/de/yageo/CC0603KRX7R7BB104/311-1088-1-ND/; MANUFACTURER: Yageo; MANUFACTURERPARTNUMBER: CC0603KRX7R7BB104; POPULATED: TRUE; ROHSCERTIFICATE: RoHS3-konform; SOURCE: DIGIKEY; SOURCEPARTNUMBER: 311-1088-1-ND
C107 C108 C112 C113 = rc-sysmocom:CAP_CERAMIC: Ceramic Capacitors 0402 - 0402 Surface Mount Capacitors 16pF 50V 5% [Digikey: 445-4899-2-ND] 18pF 50V 5% [Digikey: 490-1281-2-ND] 22pF 50V 5% [Digikey: 490-1283-2-ND] 68pF 50V 5% [Digikey: 490-1289-2-ND] 0.1uF 10V 10% [Digikey: 490-1318-2-ND] 1.0uF 6.3V 10% [Digikey: 490-1320-2-ND] 0603 - 0603 Surface Mount Capacitors 16 pF 50V 5% [Digikey: 445-5051-2-ND] 22 pF 50V [Digikey: PCC220ACVTR-ND] 33 pF 50V 5% [Digikey: 490-1415-1-ND] 56pF 50V 5% [Digikey: 490-1421-1-ND] 220pF 50V 5% [Digikey: 445-1285-1-ND] 680 pF 50V 2200 pF 50V 5% C0G [Digikey: 445-1297-1-ND] 5600 pF 100V 5% X7R [Digikey: 478-3711-1-ND] 0.1 µF 25V 10% [Digikey: PCC2277TR-ND] 0.22 µF 16V 10% X7R [Digikey: 445-1318-1-ND] 1.0 µF 25V 10% [Digikey: 445-5146-2-ND] 0603 - RF Specific 3pF 250V +/-0.1pF RF [Digikey: 712-1347-1-ND] 18 pF 250V 5% [Digikey: 478-3505-1-ND or 712-1322-1-ND] 56 pF 250V 5% C0G RF [Digikey: 490-4867-1-ND] 68 pF 250V RF [Digikey: 490-4868-1-ND] 0805 - 0805 Surface Mount Capacitors 220 pF 250V 2% RF Ceramic Capacitor [Digikey: 712-1398-1-ND] 1000 pF 50V 2% NP0 Ceramic Capacitor [Digikey: 478-3760-1-ND] 0.1 µF 25V 10% Ceramic Capacitor [Digikey: PCC1828TR-ND] 1.0 µF 16V 10% Ceramic Capacitor[Digikey: 490-1691-2-ND] 10.0 µF 10V 10% Ceramic Capacitor[Digikey: 709-1228-1-ND] 10.0 uF 16V 10% Ceramic Capacitor [Digikey: 478-5165-2-ND] 47 uF 6.3V 20% Ceramic Capacitor [Digikey: 587-1779-1-ND or 399-5506-1-ND] 1206 - 1206 Surface Mount Capacitors 47uF 10V 20% Ceramic Capacitor [Digikey: 490-5528-1-ND or 399-5508-1-ND or 445-6010-1-ND] 100uF 6.3V -20%, +80% Y5V Ceramic Capacitor (Digikey: 490-4512-1-ND, Mouser: 81-GRM31CF50J107ZE1L) 1810 - 1810 Surface Mount Capacitors High volt MLC; no solder stop between for higher isolation; CLASS: CAPACITOR; DESCRIPTION: CAP CER 100UF 6.3V X5R 1206; LINK: https://www.digikey.de/product-detail/de/tdk-corporation/C3216X5R0J107M160AB/445-6008-1-ND; MANUFACTURER: TDK Corporation; MANUFACTURERPARTNUMBER: C3216X5R0J107M160AB; POPULATED: TRUE; ROHSCERTIFICATE: RoHS3-konform; SOURCE: DIGIKEY; SOURCEPARTNUMBER: 445-6008-1-ND
C111 C116 = rc-sysmocom:CAP_CERAMIC: Ceramic Capacitors 0402 - 0402 Surface Mount Capacitors 16pF 50V 5% [Digikey: 445-4899-2-ND] 18pF 50V 5% [Digikey: 490-1281-2-ND] 22pF 50V 5% [Digikey: 490-1283-2-ND] 68pF 50V 5% [Digikey: 490-1289-2-ND] 0.1uF 10V 10% [Digikey: 490-1318-2-ND] 1.0uF 6.3V 10% [Digikey: 490-1320-2-ND] 0603 - 0603 Surface Mount Capacitors 16 pF 50V 5% [Digikey: 445-5051-2-ND] 22 pF 50V [Digikey: PCC220ACVTR-ND] 33 pF 50V 5% [Digikey: 490-1415-1-ND] 56pF 50V 5% [Digikey: 490-1421-1-ND] 220pF 50V 5% [Digikey: 445-1285-1-ND] 680 pF 50V 2200 pF 50V 5% C0G [Digikey: 445-1297-1-ND] 5600 pF 100V 5% X7R [Digikey: 478-3711-1-ND] 0.1 µF 25V 10% [Digikey: PCC2277TR-ND] 0.22 µF 16V 10% X7R [Digikey: 445-1318-1-ND] 1.0 µF 25V 10% [Digikey: 445-5146-2-ND] 0603 - RF Specific 3pF 250V +/-0.1pF RF [Digikey: 712-1347-1-ND] 18 pF 250V 5% [Digikey: 478-3505-1-ND or 712-1322-1-ND] 56 pF 250V 5% C0G RF [Digikey: 490-4867-1-ND] 68 pF 250V RF [Digikey: 490-4868-1-ND] 0805 - 0805 Surface Mount Capacitors 220 pF 250V 2% RF Ceramic Capacitor [Digikey: 712-1398-1-ND] 1000 pF 50V 2% NP0 Ceramic Capacitor [Digikey: 478-3760-1-ND] 0.1 µF 25V 10% Ceramic Capacitor [Digikey: PCC1828TR-ND] 1.0 µF 16V 10% Ceramic Capacitor[Digikey: 490-1691-2-ND] 10.0 µF 10V 10% Ceramic Capacitor[Digikey: 709-1228-1-ND] 10.0 uF 16V 10% Ceramic Capacitor [Digikey: 478-5165-2-ND] 47 uF 6.3V 20% Ceramic Capacitor [Digikey: 587-1779-1-ND or 399-5506-1-ND] 1206 - 1206 Surface Mount Capacitors 47uF 10V 20% Ceramic Capacitor [Digikey: 490-5528-1-ND or 399-5508-1-ND or 445-6010-1-ND] 100uF 6.3V -20%, +80% Y5V Ceramic Capacitor (Digikey: 490-4512-1-ND, Mouser: 81-GRM31CF50J107ZE1L) 1810 - 1810 Surface Mount Capacitors High volt MLC; no solder stop between for higher isolation; CLASS: CAPACITOR; DESCRIPTION: CAP CER 10PF 50V C0G/NP0 0603; LINK: https://www.digikey.de/product-detail/de/kemet/C0603C100F5GAC7867/399-9958-1-ND; MANUFACTURER: KEMET; MANUFACTURERPARTNUMBER: C0603C100F5GAC7867; POPULATED: TRUE; ROHSCERTIFICATE: RoHS3-konform; SOURCE: DIGIKEY; SOURCEPARTNUMBER: 399-9958-1-ND
C203 C206-C215 = rc-sysmocom:CAP_CERAMIC: Ceramic Capacitors 0402 - 0402 Surface Mount Capacitors 16pF 50V 5% [Digikey: 445-4899-2-ND] 18pF 50V 5% [Digikey: 490-1281-2-ND] 22pF 50V 5% [Digikey: 490-1283-2-ND] 68pF 50V 5% [Digikey: 490-1289-2-ND] 0.1uF 10V 10% [Digikey: 490-1318-2-ND] 1.0uF 6.3V 10% [Digikey: 490-1320-2-ND] 0603 - 0603 Surface Mount Capacitors 16 pF 50V 5% [Digikey: 445-5051-2-ND] 22 pF 50V [Digikey: PCC220ACVTR-ND] 33 pF 50V 5% [Digikey: 490-1415-1-ND] 56pF 50V 5% [Digikey: 490-1421-1-ND] 220pF 50V 5% [Digikey: 445-1285-1-ND] 680 pF 50V 2200 pF 50V 5% C0G [Digikey: 445-1297-1-ND] 5600 pF 100V 5% X7R [Digikey: 478-3711-1-ND] 0.1 µF 25V 10% [Digikey: PCC2277TR-ND] 0.22 µF 16V 10% X7R [Digikey: 445-1318-1-ND] 1.0 µF 25V 10% [Digikey: 445-5146-2-ND] 0603 - RF Specific 3pF 250V +/-0.1pF RF [Digikey: 712-1347-1-ND] 18 pF 250V 5% [Digikey: 478-3505-1-ND or 712-1322-1-ND] 56 pF 250V 5% C0G RF [Digikey: 490-4867-1-ND] 68 pF 250V RF [Digikey: 490-4868-1-ND] 0805 - 0805 Surface Mount Capacitors 220 pF 250V 2% RF Ceramic Capacitor [Digikey: 712-1398-1-ND] 1000 pF 50V 2% NP0 Ceramic Capacitor [Digikey: 478-3760-1-ND] 0.1 µF 25V 10% Ceramic Capacitor [Digikey: PCC1828TR-ND] 1.0 µF 16V 10% Ceramic Capacitor[Digikey: 490-1691-2-ND] 10.0 µF 10V 10% Ceramic Capacitor[Digikey: 709-1228-1-ND] 10.0 uF 16V 10% Ceramic Capacitor [Digikey: 478-5165-2-ND] 47 uF 6.3V 20% Ceramic Capacitor [Digikey: 587-1779-1-ND or 399-5506-1-ND] 1206 - 1206 Surface Mount Capacitors 47uF 10V 20% Ceramic Capacitor [Digikey: 490-5528-1-ND or 399-5508-1-ND or 445-6010-1-ND] 100uF 6.3V -20%, +80% Y5V Ceramic Capacitor (Digikey: 490-4512-1-ND, Mouser: 81-GRM31CF50J107ZE1L) 1810 - 1810 Surface Mount Capacitors High volt MLC; no solder stop between for higher isolation; CLASS: CAPACITOR; DESCRIPTION: CAP CER 0.1UF 16V X7R 0402; LINK: https://www.digikey.de/product-detail/de/samsung-electro-mechanics/CL05B104KO5NNWC/1276-1509-2-ND/; MANUFACTURER: Samsung Electro-Mechanics; MANUFACTURERPARTNUMBER: CL05B104KO5NNWC; POPULATED: TRUE; ROHSCERTIFICATE: RoHS3-konform; SOURCE: DIGIKEY; SOURCEPARTNUMBER: 1276-1509-2-ND
C204 C205 = rc-sysmocom:CAP_CERAMIC: Ceramic Capacitors 0402 - 0402 Surface Mount Capacitors 16pF 50V 5% [Digikey: 445-4899-2-ND] 18pF 50V 5% [Digikey: 490-1281-2-ND] 22pF 50V 5% [Digikey: 490-1283-2-ND] 68pF 50V 5% [Digikey: 490-1289-2-ND] 0.1uF 10V 10% [Digikey: 490-1318-2-ND] 1.0uF 6.3V 10% [Digikey: 490-1320-2-ND] 0603 - 0603 Surface Mount Capacitors 16 pF 50V 5% [Digikey: 445-5051-2-ND] 22 pF 50V [Digikey: PCC220ACVTR-ND] 33 pF 50V 5% [Digikey: 490-1415-1-ND] 56pF 50V 5% [Digikey: 490-1421-1-ND] 220pF 50V 5% [Digikey: 445-1285-1-ND] 680 pF 50V 2200 pF 50V 5% C0G [Digikey: 445-1297-1-ND] 5600 pF 100V 5% X7R [Digikey: 478-3711-1-ND] 0.1 µF 25V 10% [Digikey: PCC2277TR-ND] 0.22 µF 16V 10% X7R [Digikey: 445-1318-1-ND] 1.0 µF 25V 10% [Digikey: 445-5146-2-ND] 0603 - RF Specific 3pF 250V +/-0.1pF RF [Digikey: 712-1347-1-ND] 18 pF 250V 5% [Digikey: 478-3505-1-ND or 712-1322-1-ND] 56 pF 250V 5% C0G RF [Digikey: 490-4867-1-ND] 68 pF 250V RF [Digikey: 490-4868-1-ND] 0805 - 0805 Surface Mount Capacitors 220 pF 250V 2% RF Ceramic Capacitor [Digikey: 712-1398-1-ND] 1000 pF 50V 2% NP0 Ceramic Capacitor [Digikey: 478-3760-1-ND] 0.1 µF 25V 10% Ceramic Capacitor [Digikey: PCC1828TR-ND] 1.0 µF 16V 10% Ceramic Capacitor[Digikey: 490-1691-2-ND] 10.0 µF 10V 10% Ceramic Capacitor[Digikey: 709-1228-1-ND] 10.0 uF 16V 10% Ceramic Capacitor [Digikey: 478-5165-2-ND] 47 uF 6.3V 20% Ceramic Capacitor [Digikey: 587-1779-1-ND or 399-5506-1-ND] 1206 - 1206 Surface Mount Capacitors 47uF 10V 20% Ceramic Capacitor [Digikey: 490-5528-1-ND or 399-5508-1-ND or 445-6010-1-ND] 100uF 6.3V -20%, +80% Y5V Ceramic Capacitor (Digikey: 490-4512-1-ND, Mouser: 81-GRM31CF50J107ZE1L) 1810 - 1810 Surface Mount Capacitors High volt MLC; no solder stop between for higher isolation; CLASS: CAPACITOR; DESCRIPTION: CAP CER 2.2UF 10V X5R 0603; LINK: http://www.digikey.de/product-detail/de/0603ZD225KAT2A/478-6212-1-ND; MANUFACTURER: AVX Corporation; MANUFACTURERPARTNUMBER: 0603ZD225KAT2A; POPULATED: TRUE; ROHSCERTIFICATE: Bleifrei / RoHS-konform; SOURCE: DIGIKEY; SOURCEPARTNUMBER: 478-6212-1-ND
C216 C217 = rc-sysmocom:CAP_CERAMIC: Ceramic Capacitors 0402 - 0402 Surface Mount Capacitors 16pF 50V 5% [Digikey: 445-4899-2-ND] 18pF 50V 5% [Digikey: 490-1281-2-ND] 22pF 50V 5% [Digikey: 490-1283-2-ND] 68pF 50V 5% [Digikey: 490-1289-2-ND] 0.1uF 10V 10% [Digikey: 490-1318-2-ND] 1.0uF 6.3V 10% [Digikey: 490-1320-2-ND] 0603 - 0603 Surface Mount Capacitors 16 pF 50V 5% [Digikey: 445-5051-2-ND] 22 pF 50V [Digikey: PCC220ACVTR-ND] 33 pF 50V 5% [Digikey: 490-1415-1-ND] 56pF 50V 5% [Digikey: 490-1421-1-ND] 220pF 50V 5% [Digikey: 445-1285-1-ND] 680 pF 50V 2200 pF 50V 5% C0G [Digikey: 445-1297-1-ND] 5600 pF 100V 5% X7R [Digikey: 478-3711-1-ND] 0.1 µF 25V 10% [Digikey: PCC2277TR-ND] 0.22 µF 16V 10% X7R [Digikey: 445-1318-1-ND] 1.0 µF 25V 10% [Digikey: 445-5146-2-ND] 0603 - RF Specific 3pF 250V +/-0.1pF RF [Digikey: 712-1347-1-ND] 18 pF 250V 5% [Digikey: 478-3505-1-ND or 712-1322-1-ND] 56 pF 250V 5% C0G RF [Digikey: 490-4867-1-ND] 68 pF 250V RF [Digikey: 490-4868-1-ND] 0805 - 0805 Surface Mount Capacitors 220 pF 250V 2% RF Ceramic Capacitor [Digikey: 712-1398-1-ND] 1000 pF 50V 2% NP0 Ceramic Capacitor [Digikey: 478-3760-1-ND] 0.1 µF 25V 10% Ceramic Capacitor [Digikey: PCC1828TR-ND] 1.0 µF 16V 10% Ceramic Capacitor[Digikey: 490-1691-2-ND] 10.0 µF 10V 10% Ceramic Capacitor[Digikey: 709-1228-1-ND] 10.0 uF 16V 10% Ceramic Capacitor [Digikey: 478-5165-2-ND] 47 uF 6.3V 20% Ceramic Capacitor [Digikey: 587-1779-1-ND or 399-5506-1-ND] 1206 - 1206 Surface Mount Capacitors 47uF 10V 20% Ceramic Capacitor [Digikey: 490-5528-1-ND or 399-5508-1-ND or 445-6010-1-ND] 100uF 6.3V -20%, +80% Y5V Ceramic Capacitor (Digikey: 490-4512-1-ND, Mouser: 81-GRM31CF50J107ZE1L) 1810 - 1810 Surface Mount Capacitors High volt MLC; no solder stop between for higher isolation; CLASS: CAPACITOR; DESCRIPTION: CAP CER 18PF 100V 5% NP0 0603; LINK: http://www.digikey.de/product-detail/de/GRM1885C2A180JA01D/490-1333-1-ND/587702; MANUFACTURER: Murata Electronics North America; MANUFACTURERPARTNUMBER: GRM1885C2A180JA01D; POPULATED: TRUE; ROHSCERTIFICATE: Bleifrei / RoHS-konform; SOURCE: DIGIKEY; SOURCEPARTNUMBER: 490-1333-1-ND
C218 = rc-sysmocom:CAP_CERAMIC: Ceramic Capacitors 0402 - 0402 Surface Mount Capacitors 16pF 50V 5% [Digikey: 445-4899-2-ND] 18pF 50V 5% [Digikey: 490-1281-2-ND] 22pF 50V 5% [Digikey: 490-1283-2-ND] 68pF 50V 5% [Digikey: 490-1289-2-ND] 0.1uF 10V 10% [Digikey: 490-1318-2-ND] 1.0uF 6.3V 10% [Digikey: 490-1320-2-ND] 0603 - 0603 Surface Mount Capacitors 16 pF 50V 5% [Digikey: 445-5051-2-ND] 22 pF 50V [Digikey: PCC220ACVTR-ND] 33 pF 50V 5% [Digikey: 490-1415-1-ND] 56pF 50V 5% [Digikey: 490-1421-1-ND] 220pF 50V 5% [Digikey: 445-1285-1-ND] 680 pF 50V 2200 pF 50V 5% C0G [Digikey: 445-1297-1-ND] 5600 pF 100V 5% X7R [Digikey: 478-3711-1-ND] 0.1 µF 25V 10% [Digikey: PCC2277TR-ND] 0.22 µF 16V 10% X7R [Digikey: 445-1318-1-ND] 1.0 µF 25V 10% [Digikey: 445-5146-2-ND] 0603 - RF Specific 3pF 250V +/-0.1pF RF [Digikey: 712-1347-1-ND] 18 pF 250V 5% [Digikey: 478-3505-1-ND or 712-1322-1-ND] 56 pF 250V 5% C0G RF [Digikey: 490-4867-1-ND] 68 pF 250V RF [Digikey: 490-4868-1-ND] 0805 - 0805 Surface Mount Capacitors 220 pF 250V 2% RF Ceramic Capacitor [Digikey: 712-1398-1-ND] 1000 pF 50V 2% NP0 Ceramic Capacitor [Digikey: 478-3760-1-ND] 0.1 µF 25V 10% Ceramic Capacitor [Digikey: PCC1828TR-ND] 1.0 µF 16V 10% Ceramic Capacitor[Digikey: 490-1691-2-ND] 10.0 µF 10V 10% Ceramic Capacitor[Digikey: 709-1228-1-ND] 10.0 uF 16V 10% Ceramic Capacitor [Digikey: 478-5165-2-ND] 47 uF 6.3V 20% Ceramic Capacitor [Digikey: 587-1779-1-ND or 399-5506-1-ND] 1206 - 1206 Surface Mount Capacitors 47uF 10V 20% Ceramic Capacitor [Digikey: 490-5528-1-ND or 399-5508-1-ND or 445-6010-1-ND] 100uF 6.3V -20%, +80% Y5V Ceramic Capacitor (Digikey: 490-4512-1-ND, Mouser: 81-GRM31CF50J107ZE1L) 1810 - 1810 Surface Mount Capacitors High volt MLC; no solder stop between for higher isolation; CLASS: CAPACITOR; DESCRIPTION: CAP CER 1000PF 16V 10% X7R 0402; LINK: http://www.digikey.de/product-detail/de/CC0402KRX7R7BB102/311-1352-1-ND; MANUFACTURER: Yageo; MANUFACTURERPARTNUMBER: CC0402KRX7R7BB102; POPULATED: FALSE; ROHSCERTIFICATE: Bleifrei / RoHS-konform; SOURCE: DIGIKEY; SOURCEPARTNUMBER: 311-1352-1-ND
C301 = rcl:CPOL-EU: POLARIZED CAPACITOR, European symbol; CLASS: CAPACITOR; DESCRIPTION: CAP ALUM 220UF 20%% 25V SMD; LINK: https://www.digikey.de/product-detail/de/nichicon/UUD1E221MNL1GS/493-2278-1-ND/; MANUFACTURER: Nichicon; MANUFACTURERPARTNUMBER: UUD1E221MNL1GS; POPULATED: TRUE; ROHSCERTIFICATE: RoHS3-konform; SOURCE: DIGIKEY; SOURCEPARTNUMBER: 493-2278-1-ND
C302 = rc-sysmocom:CAP_CERAMIC: Ceramic Capacitors 0402 - 0402 Surface Mount Capacitors 16pF 50V 5% [Digikey: 445-4899-2-ND] 18pF 50V 5% [Digikey: 490-1281-2-ND] 22pF 50V 5% [Digikey: 490-1283-2-ND] 68pF 50V 5% [Digikey: 490-1289-2-ND] 0.1uF 10V 10% [Digikey: 490-1318-2-ND] 1.0uF 6.3V 10% [Digikey: 490-1320-2-ND] 0603 - 0603 Surface Mount Capacitors 16 pF 50V 5% [Digikey: 445-5051-2-ND] 22 pF 50V [Digikey: PCC220ACVTR-ND] 33 pF 50V 5% [Digikey: 490-1415-1-ND] 56pF 50V 5% [Digikey: 490-1421-1-ND] 220pF 50V 5% [Digikey: 445-1285-1-ND] 680 pF 50V 2200 pF 50V 5% C0G [Digikey: 445-1297-1-ND] 5600 pF 100V 5% X7R [Digikey: 478-3711-1-ND] 0.1 µF 25V 10% [Digikey: PCC2277TR-ND] 0.22 µF 16V 10% X7R [Digikey: 445-1318-1-ND] 1.0 µF 25V 10% [Digikey: 445-5146-2-ND] 0603 - RF Specific 3pF 250V +/-0.1pF RF [Digikey: 712-1347-1-ND] 18 pF 250V 5% [Digikey: 478-3505-1-ND or 712-1322-1-ND] 56 pF 250V 5% C0G RF [Digikey: 490-4867-1-ND] 68 pF 250V RF [Digikey: 490-4868-1-ND] 0805 - 0805 Surface Mount Capacitors 220 pF 250V 2% RF Ceramic Capacitor [Digikey: 712-1398-1-ND] 1000 pF 50V 2% NP0 Ceramic Capacitor [Digikey: 478-3760-1-ND] 0.1 µF 25V 10% Ceramic Capacitor [Digikey: PCC1828TR-ND] 1.0 µF 16V 10% Ceramic Capacitor[Digikey: 490-1691-2-ND] 10.0 µF 10V 10% Ceramic Capacitor[Digikey: 709-1228-1-ND] 10.0 uF 16V 10% Ceramic Capacitor [Digikey: 478-5165-2-ND] 47 uF 6.3V 20% Ceramic Capacitor [Digikey: 587-1779-1-ND or 399-5506-1-ND] 1206 - 1206 Surface Mount Capacitors 47uF 10V 20% Ceramic Capacitor [Digikey: 490-5528-1-ND or 399-5508-1-ND or 445-6010-1-ND] 100uF 6.3V -20%, +80% Y5V Ceramic Capacitor (Digikey: 490-4512-1-ND, Mouser: 81-GRM31CF50J107ZE1L) 1810 - 1810 Surface Mount Capacitors High volt MLC; no solder stop between for higher isolation; CLASS: CAPACITOR; DESCRIPTION: CAP CER 10UF 25V X7R 1812; LINK: https://www.digikey.de/product-detail/de/tdk-corporation/C4532X7R1E106M250KA/445-1445-1-ND; MANUFACTURER: TDK Corporation; MANUFACTURERPARTNUMBER: C4532X7R1E106M250KA; POPULATED: TRUE; ROHSCERTIFICATE: RoHS3-konform; SOURCE: DIGIKEY; SOURCEPARTNUMBER: 445-1445-1-ND
C304 C305 = rc-sysmocom:CAP_CERAMIC: Ceramic Capacitors 0402 - 0402 Surface Mount Capacitors 16pF 50V 5% [Digikey: 445-4899-2-ND] 18pF 50V 5% [Digikey: 490-1281-2-ND] 22pF 50V 5% [Digikey: 490-1283-2-ND] 68pF 50V 5% [Digikey: 490-1289-2-ND] 0.1uF 10V 10% [Digikey: 490-1318-2-ND] 1.0uF 6.3V 10% [Digikey: 490-1320-2-ND] 0603 - 0603 Surface Mount Capacitors 16 pF 50V 5% [Digikey: 445-5051-2-ND] 22 pF 50V [Digikey: PCC220ACVTR-ND] 33 pF 50V 5% [Digikey: 490-1415-1-ND] 56pF 50V 5% [Digikey: 490-1421-1-ND] 220pF 50V 5% [Digikey: 445-1285-1-ND] 680 pF 50V 2200 pF 50V 5% C0G [Digikey: 445-1297-1-ND] 5600 pF 100V 5% X7R [Digikey: 478-3711-1-ND] 0.1 µF 25V 10% [Digikey: PCC2277TR-ND] 0.22 µF 16V 10% X7R [Digikey: 445-1318-1-ND] 1.0 µF 25V 10% [Digikey: 445-5146-2-ND] 0603 - RF Specific 3pF 250V +/-0.1pF RF [Digikey: 712-1347-1-ND] 18 pF 250V 5% [Digikey: 478-3505-1-ND or 712-1322-1-ND] 56 pF 250V 5% C0G RF [Digikey: 490-4867-1-ND] 68 pF 250V RF [Digikey: 490-4868-1-ND] 0805 - 0805 Surface Mount Capacitors 220 pF 250V 2% RF Ceramic Capacitor [Digikey: 712-1398-1-ND] 1000 pF 50V 2% NP0 Ceramic Capacitor [Digikey: 478-3760-1-ND] 0.1 µF 25V 10% Ceramic Capacitor [Digikey: PCC1828TR-ND] 1.0 µF 16V 10% Ceramic Capacitor[Digikey: 490-1691-2-ND] 10.0 µF 10V 10% Ceramic Capacitor[Digikey: 709-1228-1-ND] 10.0 uF 16V 10% Ceramic Capacitor [Digikey: 478-5165-2-ND] 47 uF 6.3V 20% Ceramic Capacitor [Digikey: 587-1779-1-ND or 399-5506-1-ND] 1206 - 1206 Surface Mount Capacitors 47uF 10V 20% Ceramic Capacitor [Digikey: 490-5528-1-ND or 399-5508-1-ND or 445-6010-1-ND] 100uF 6.3V -20%, +80% Y5V Ceramic Capacitor (Digikey: 490-4512-1-ND, Mouser: 81-GRM31CF50J107ZE1L) 1810 - 1810 Surface Mount Capacitors High volt MLC; no solder stop between for higher isolation; CLASS: CAPACITOR; DESCRIPTION: CAP CER 1000PF 50V X7R 0603; LINK: https://www.digikey.de/product-detail/de/samsung-electro-mechanics/CL10B102KB8NNNC/1276-1018-1-ND; MANUFACTURER: Samsung Electro-Mechanics; MANUFACTURERPARTNUMBER: CL10B102KB8NNNC; POPULATED: TRUE; ROHSCERTIFICATE: RoHS3-konform; SOURCE: DIGIKEY; SOURCEPARTNUMBER: 1276-1018-1-ND
C307 = rc-sysmocom:CAP_CERAMIC: Ceramic Capacitors 0402 - 0402 Surface Mount Capacitors 16pF 50V 5% [Digikey: 445-4899-2-ND] 18pF 50V 5% [Digikey: 490-1281-2-ND] 22pF 50V 5% [Digikey: 490-1283-2-ND] 68pF 50V 5% [Digikey: 490-1289-2-ND] 0.1uF 10V 10% [Digikey: 490-1318-2-ND] 1.0uF 6.3V 10% [Digikey: 490-1320-2-ND] 0603 - 0603 Surface Mount Capacitors 16 pF 50V 5% [Digikey: 445-5051-2-ND] 22 pF 50V [Digikey: PCC220ACVTR-ND] 33 pF 50V 5% [Digikey: 490-1415-1-ND] 56pF 50V 5% [Digikey: 490-1421-1-ND] 220pF 50V 5% [Digikey: 445-1285-1-ND] 680 pF 50V 2200 pF 50V 5% C0G [Digikey: 445-1297-1-ND] 5600 pF 100V 5% X7R [Digikey: 478-3711-1-ND] 0.1 µF 25V 10% [Digikey: PCC2277TR-ND] 0.22 µF 16V 10% X7R [Digikey: 445-1318-1-ND] 1.0 µF 25V 10% [Digikey: 445-5146-2-ND] 0603 - RF Specific 3pF 250V +/-0.1pF RF [Digikey: 712-1347-1-ND] 18 pF 250V 5% [Digikey: 478-3505-1-ND or 712-1322-1-ND] 56 pF 250V 5% C0G RF [Digikey: 490-4867-1-ND] 68 pF 250V RF [Digikey: 490-4868-1-ND] 0805 - 0805 Surface Mount Capacitors 220 pF 250V 2% RF Ceramic Capacitor [Digikey: 712-1398-1-ND] 1000 pF 50V 2% NP0 Ceramic Capacitor [Digikey: 478-3760-1-ND] 0.1 µF 25V 10% Ceramic Capacitor [Digikey: PCC1828TR-ND] 1.0 µF 16V 10% Ceramic Capacitor[Digikey: 490-1691-2-ND] 10.0 µF 10V 10% Ceramic Capacitor[Digikey: 709-1228-1-ND] 10.0 uF 16V 10% Ceramic Capacitor [Digikey: 478-5165-2-ND] 47 uF 6.3V 20% Ceramic Capacitor [Digikey: 587-1779-1-ND or 399-5506-1-ND] 1206 - 1206 Surface Mount Capacitors 47uF 10V 20% Ceramic Capacitor [Digikey: 490-5528-1-ND or 399-5508-1-ND or 445-6010-1-ND] 100uF 6.3V -20%, +80% Y5V Ceramic Capacitor (Digikey: 490-4512-1-ND, Mouser: 81-GRM31CF50J107ZE1L) 1810 - 1810 Surface Mount Capacitors High volt MLC; no solder stop between for higher isolation; CLASS: CAPACITOR; DESCRIPTION: CAP CER 47UF 10V X5R 1206; LINK: https://www.digikey.de/product-detail/de/samsung-electro-mechanics/CL31A476MPHNNNE/1276-3063-1-ND/; MANUFACTURER: Samsung Electro-Mechanics; MANUFACTURERPARTNUMBER: CL31A476MPHNNNE; POPULATED: TRUE; ROHSCERTIFICATE: RoHS3-konform; SOURCE: DIGIKEY; SOURCEPARTNUMBER: 1276-3063-1-ND
C309 = rcl:CPOL-EU: POLARIZED CAPACITOR, European symbol; CLASS: CAPACITOR; DESCRIPTION: CAP TANT 100UF 6.3V 20% 1210; LINK: http://www.digikey.de/product-detail/de/F920J107MBA/478-8116-1-ND; MANUFACTURER: AVX Corporation; MANUFACTURERPARTNUMBER: F920J107MBA; POPULATED: FALSE; ROHSCERTIFICATE: Bleifrei / RoHS-konform; SOURCE: DIGIKEY; SOURCEPARTNUMBER: 478-8116-1-ND
C310 = Wurth_Elektronik_Passive_Capacitors_rev15a:WCAP-PSLC: WCAP-PSLC Aluminum Polymer Capacitors Characteristics Alumnium Polymer Capacitor Recommended soldering: Reflow Operating temperature: -55 °C to +105 °C Large capacitance SMD product series Very low ESR at high frequency range High permissible ripple current Long life and high reliability Load life:2000 h @ +105 °C Package name and Variant abbreviation: Package: Package: B X C X A = length of the solder pad X width of the solder pad X pitch of the solder pad. Variant: D X L = Diameter of the body part X Height of the body part. <http://katalog.we-online.de/media/images/eisos/WCAP-PSLC_pf2.jpg> Details see: http://katalog.we-online.de/en/pbs/WCAP-PSLC?m Created: 2015-03-10 2015 (C) Wurth Elektronik; CLASS: CAPACITOR; DESCRIPTION: CAP ALUM POLY 330UF 20%% 6.3V SMD; LINK: https://www.digikey.de/product-detail/de/united-chemi-con/APXF6R3ARA331MH70G/565-4335-1-ND; MANUFACTURER: United Chemi-Con; MANUFACTURERPARTNUMBER: APXF6R3ARA331MH70G; POPULATED: TRUE; ROHSCERTIFICATE: RoHS3-konform; SOURCE: DIGIKEY; SOURCEPARTNUMBER: 565-4335-1-ND
C312 = rc-sysmocom:CAP_CERAMIC: Ceramic Capacitors 0402 - 0402 Surface Mount Capacitors 16pF 50V 5% [Digikey: 445-4899-2-ND] 18pF 50V 5% [Digikey: 490-1281-2-ND] 22pF 50V 5% [Digikey: 490-1283-2-ND] 68pF 50V 5% [Digikey: 490-1289-2-ND] 0.1uF 10V 10% [Digikey: 490-1318-2-ND] 1.0uF 6.3V 10% [Digikey: 490-1320-2-ND] 0603 - 0603 Surface Mount Capacitors 16 pF 50V 5% [Digikey: 445-5051-2-ND] 22 pF 50V [Digikey: PCC220ACVTR-ND] 33 pF 50V 5% [Digikey: 490-1415-1-ND] 56pF 50V 5% [Digikey: 490-1421-1-ND] 220pF 50V 5% [Digikey: 445-1285-1-ND] 680 pF 50V 2200 pF 50V 5% C0G [Digikey: 445-1297-1-ND] 5600 pF 100V 5% X7R [Digikey: 478-3711-1-ND] 0.1 µF 25V 10% [Digikey: PCC2277TR-ND] 0.22 µF 16V 10% X7R [Digikey: 445-1318-1-ND] 1.0 µF 25V 10% [Digikey: 445-5146-2-ND] 0603 - RF Specific 3pF 250V +/-0.1pF RF [Digikey: 712-1347-1-ND] 18 pF 250V 5% [Digikey: 478-3505-1-ND or 712-1322-1-ND] 56 pF 250V 5% C0G RF [Digikey: 490-4867-1-ND] 68 pF 250V RF [Digikey: 490-4868-1-ND] 0805 - 0805 Surface Mount Capacitors 220 pF 250V 2% RF Ceramic Capacitor [Digikey: 712-1398-1-ND] 1000 pF 50V 2% NP0 Ceramic Capacitor [Digikey: 478-3760-1-ND] 0.1 µF 25V 10% Ceramic Capacitor [Digikey: PCC1828TR-ND] 1.0 µF 16V 10% Ceramic Capacitor[Digikey: 490-1691-2-ND] 10.0 µF 10V 10% Ceramic Capacitor[Digikey: 709-1228-1-ND] 10.0 uF 16V 10% Ceramic Capacitor [Digikey: 478-5165-2-ND] 47 uF 6.3V 20% Ceramic Capacitor [Digikey: 587-1779-1-ND or 399-5506-1-ND] 1206 - 1206 Surface Mount Capacitors 47uF 10V 20% Ceramic Capacitor [Digikey: 490-5528-1-ND or 399-5508-1-ND or 445-6010-1-ND] 100uF 6.3V -20%, +80% Y5V Ceramic Capacitor (Digikey: 490-4512-1-ND, Mouser: 81-GRM31CF50J107ZE1L) 1810 - 1810 Surface Mount Capacitors High volt MLC; no solder stop between for higher isolation; CLASS: CAPACITOR; DESCRIPTION: NO DESCRIPTION; LINK: UNKNOWN LINK; MANUFACTURER: UNKNOWN MANUFACTURER; MANUFACTURERPARTNUMBER: UNKNOWN MANUFACTURER PART NUMBER; POPULATED: FALSE; ROHSCERTIFICATE: UNKNOWN ROHS CERTIFICATE; SOURCE: UNKNOWN SOURCE; SOURCEPARTNUMBER: UNKNOWN SOURCE PART NUMBER
C313 = rcl:CPOL-EU: POLARIZED CAPACITOR, European symbol; CLASS: CAPACITOR; DESCRIPTION: NO DESCRIPTION; LINK: UNKNOWN LINK; MANUFACTURER: UNKNOWN MANUFACTURER; MANUFACTURERPARTNUMBER: UNKNOWN MANUFACTURER PART NUMBER; POPULATED: TRUE; ROHSCERTIFICATE: UNKNOWN ROHS CERTIFICATE; SOURCE: UNKNOWN SOURCE; SOURCEPARTNUMBER: UNKNOWN SOURCE PART NUMBER
D101 = laforge:PESD5V0UBV: NXP PESD5V0U5BV 5-channel bidirectional TVS array; CLASS: DIODE; DESCRIPTION: TVS DIODE 5V SOT666; LINK: https://www.digikey.de/product-detail/de/nexperia-usa-inc/PESD5V0U5BV,115/1727-5806-1-ND; MANUFACTURER: Nexperia USA Inc.; MANUFACTURERPARTNUMBER: PESD5V0U5BV,115; OC_DIGIKEY: 568-7356-1-ND; POPULATED: TRUE; ROHSCERTIFICATE: RoHS3-konform; SOURCE: DIGIKEY; SOURCEPARTNUMBER: 1727-5806-1-ND
D102 = SP3012:SP3012-6UTG: SP3012 Series 0.5pF TVS diode array for USB3.0 3,4 and 6 ch SOT23-6, µDFN-6, µDFN-10, µDFN-14; CLASS: DIODE; DESCRIPTION: TVS DIODE 5V 7V 14UDFN; LINK: https://www.digikey.de/product-detail/de/littelfuse-inc/SP3012-06UTG/F5914CT-ND; MANUFACTURER: Littelfuse Inc.; MANUFACTURERPARTNUMBER: SP3012-06UTG; POPULATED: TRUE; ROHSCERTIFICATE: RoHS3-konform; SOURCE: DIGIKEY; SOURCEPARTNUMBER: F5914CT-ND
D301 = diodes-sysmocom:DIODE-SCHOTTKY: Diode SMA Model Volts Amps Type Vf Vr Digikey # Notes SSA34-E3 40V 3A Schottky 480mV @ 3A 200uA @ 40V SSA34-E3/61TGITR-ND CDBA120-G 20V 1A Schottky 500mV @ 1A 500uA @ 20V 641-1014-6-ND REEL MBRA210 10V 2A Schottky 350mV @ 2A 700uA @ 10V MBRA210LT3 SOD-123 Model Volts Amps Type Vf Vr Order # Notes BAT54T1G 30V 200mA Schottky 800mV @ 200mA 2uA @ 25V BAT54T1GOSTR-ND B0530W 30V 500mA Schottky 430mV @ 500mA 130uA @ 30V B0530W-FDICT-ND REEL MBR120 1A 20V Schottky 340mV @ 1A MBR120VLSFT1GOSCT-ND SOD-323 Model Volts Amps Type Vf Vr Order # Notes PMEG2005EJ 20V 500mA Schottky 355mV @ 500mA 568-4110-1-ND ZLLS410 10V 570mA Schottky 380mV @ 570mA ZLLS410CT-ND 1N4148WS 75V 150mA Silicon/Simple 1V 1N4148WSFSCT-ND REEL SOD-523 Model Volts Amps Type Vf Vr Order # Notes BAT54XV2 30V 200mA Schottky 0.8V @ 100mA BAT54XV2CT-ND TB751S 30V 30mA Schottky RB751S-40TE61CT-ND SOT23-R/W (R = Solder Paste/Reflow Ovens, W = Hand-Soldering) Model Volts Amps Type Vf Vr Order # Notes BAT54FILM 40V 300mA Schottky 497-7162-1-ND; CLASS: DIODE; DESCRIPTION: DIODE SCHOTTKY 50V 3A SMB; LINK: https://www.digikey.de/product-detail/de/diodes-incorporated/B350B-13-F/B350B-FDICT-ND; MANUFACTURER: Diodes Incorporated; MANUFACTURERPARTNUMBER: B350B-13-F; POPULATED: TRUE; ROHSCERTIFICATE: RoHS3-konform; SOURCE: DIGIKEY; SOURCEPARTNUMBER: B350B-FDICT-ND
D302 = diodes-sysmocom:DIODE-TVS; CLASS: DIODE; DESCRIPTION: TVS DIODE 13.6VWM 22.5VC SMB; LINK: https://www.digikey.de/product-detail/de/littelfuse-inc/SZP6SMB16AT3G/F11614CT-ND; MANUFACTURER: Littelfuse Inc.; MANUFACTURERPARTNUMBER: SZP6SMB16AT3G; POPULATED: TRUE; ROHSCERTIFICATE: RoHS3-konform; SOURCE: DIGIKEY; SOURCEPARTNUMBER: F11614CT-ND
DCDC301 = DC-DC_CONVERTER:DCDC-GE-PVX; CLASS: DC/DC CONVERTER; DESCRIPTION: DC DC CONVERTER 0.591-5.5V 15W; LINK: https://www.digikey.de/product-detail/de/murata-power-solutions-inc/OKL-T-3-W12P-C/811-2709-1-ND; MANUFACTURER: Murata Power Solutions Inc.; MANUFACTURERPARTNUMBER: OKL-T/3-W12P-C; POPULATED: TRUE; ROHSCERTIFICATE: RoHS-konform; SOURCE: DIGIKEY; SOURCEPARTNUMBER: 811-2709-1-ND
H301-H304 = holes:MOUNT-PAD-ROUND: MOUNTING PAD, round; CLASS: HOLE; DESCRIPTION: NO DESCRIPTION; LINK: UNKNOWN LINK; MANUFACTURER: UNKNOWN MANUFACTURER; MANUFACTURERPARTNUMBER: UNKNOWN MANUFACTURER PART NUMBER; POPULATED: FALSE; ROHSCERTIFICATE: UNKNOWN ROHS CERTIFICATE; SOURCE: UNKNOWN SOURCE; SOURCEPARTNUMBER: UNKNOWN SOURCE PART NUMBER
IC201 IC202 = CB3Q3244:CB3Q3244: SN74CB3Q3244 octal FET bus switch; CLASS: IC; DESCRIPTION: IC BUS SWITCH 4 X 1:1 20TSSOP; LINK: https://www.digikey.de/product-detail/de/texas-instruments/SN74CB3Q3244PWR/296-17824-1-ND/; MANUFACTURER: Texas Instruments; MANUFACTURERPARTNUMBER: SN74CB3Q3244PWR; POPULATED: TRUE; ROHSCERTIFICATE: RoHS3-konform; SOURCE: DIGIKEY; SOURCEPARTNUMBER: 296-17824-1-ND
IC203 = laforge:IP4234CZ6: NXP IP4234CZ6 - Single USB 2.0 ESD protection to IEC 61000-4-2 level 4; CLASS: TVS ARRAY; DESCRIPTION: TVS DIODE 5.5VWM 6TSOP; LINK: https://www.digikey.de/product-detail/de/nexperia-usa-inc/IP4234CZ6-115/1727-1217-1-ND; MANUFACTURER: Nexperia USA Inc.; MANUFACTURERPARTNUMBER: IP4234CZ6,115; POPULATED: TRUE; ROHSCERTIFICATE: RoHS3-konform; SOURCE: DIGIKEY; SOURCEPARTNUMBER: 1727-1217-1-ND
IC204 IC205 = FPF2109:FPF21XX: ONsemi FPF2108-FPF2110 IntelliMAXTM Advanced Load Management Products; CLASS: IC; DESCRIPTION: IC PWR SWITCH P-CHAN 1:1 SOT23-5; LINK: https://www.digikey.de/product-detail/de/on-semiconductor/FPF2109/FPF2109CT-ND; MANUFACTURER: ON Semiconductor; MANUFACTURERPARTNUMBER: FPF2109; POPULATED: TRUE; ROHSCERTIFICATE: RoHS3-konform; SOURCE: DIGIKEY; SOURCEPARTNUMBER: FPF2109CT-ND
IC301 = TPS22958:TPS22958: IC PWR SWITCH N-CHAN 1:1 8MSOP 14mOhm, 6A (DGN) or 4A (DGK); CLASS: IC; DESCRIPTION: IC PWR SWITCH N-CHAN 1:1 8MSOP; LINK: https://www.digikey.de/product-detail/de/texas-instruments/TPS22958DGNR/296-47367-1-ND; MANUFACTURER: Texas Instruments; MANUFACTURERPARTNUMBER: TPS22958DGNR; POPULATED: TRUE; ROHSCERTIFICATE: RoHS3-konform; SOURCE: DIGIKEY; SOURCEPARTNUMBER: 296-47367-1-ND
IC302 = TPS22958:TPS22958: IC PWR SWITCH N-CHAN 1:1 8MSOP 14mOhm, 6A (DGN) or 4A (DGK); CLASS: IC; DESCRIPTION: IC PWR SWITCH N-CHAN 1:1 8VSSOP; LINK: https://www.digikey.de/product-detail/de/texas-instruments/TPS22958NDGKR/296-48728-1-ND/; MANUFACTURER: Texas Instruments; MANUFACTURERPARTNUMBER: TPS22958NDGKR; POPULATED: TRUE; ROHSCERTIFICATE: RoHS3-konform; SOURCE: DIGIKEY; SOURCEPARTNUMBER: 296-48728-1-ND
J301 = Wurth_Elektronik_Electromechanic_DC_Power_Jack_Connectors_rev15c:694108106102: WR-DC_DC Power Jack_Right Angled_SMT Center Pin Ø2.5_Plug ID Ø2.55_Plug OD Ø5.5_with 4 Soldering Pad & Peg ;=>Code : Con_WR-DC_SMT_694108106102_694108106102 <http://katalog.we-online.de/media/images/eican/Con_WR-DC_SMT_694108106102_pf2.jpg> Details see: http://katalog.we-online.de/em/datasheet/6941xx106102.pdf Created 2014-10-08, Karrer Zheng 2014 (C) Wurth Elektronik; CLASS: CONNECTOR\JUMPER; DESCRIPTION: CONN PWR JACK 2.5X5.5MM SOLDER; LINK: https://www.digikey.de/product-detail/de/cui-inc/PJ-002BH-SMT-TR/CP-002BHPJCT-ND; MANUFACTURER: CUI Devices; MANUFACTURERPARTNUMBER: PJ-002BH-SMT-TR; POPULATED: TRUE; ROHSCERTIFICATE: RoHS-konform; SOURCE: DIGIKEY; SOURCEPARTNUMBER: CP-002BHPJCT-ND
JP102 JP103 = SparkFun:FIDUCIAL: Fiducial Alignment Points Various fiducial points for machine vision alignment.; CLASS: CONNECTOR\JUMPER; DESCRIPTION: NO DESCRIPTION; LINK: UNKNOWN LINK; MANUFACTURER: UNKNOWN MANUFACTURER; MANUFACTURERPARTNUMBER: UNKNOWN MANUFACTURER PART NUMBER; POPULATED: FALSE; ROHSCERTIFICATE: UNKNOWN ROHS CERTIFICATE; SOURCE: UNKNOWN SOURCE; SOURCEPARTNUMBER: UNKNOWN SOURCE PART NUMBER
L201 = Wuerth_Elektronik_eiSos_V6_20140807:WE-CNSW: SMD Common Mode Noise Suppressor WE-CNSW - High common mode suppression at high frequency - Small influence for high speed signals through winding symmetry -- USB 2.0 -- Firewire / IEEE 1394 -- Power supply systems -- High Speed Data Lines -- Common mode data line filter <http://katalog.we-online.de/media/images/eisos/IndCNSW_pf2.jpg> Details see: http://katalog.we-online.de/en/pbs/WE-CNSW Updated by Dan Xu 2014-06-30 2014 (C) Würth Elektronik; CLASS: INDUCTOR; DESCRIPTION: CMC 400MA 2LN 90OHM SMD AEC-Q200; LINK: https://www.digikey.de/product-detail/de/bourns-inc/SRF2012A-900YA/SRF2012A-900YACT-ND; MANUFACTURER: Bourns Inc.; MANUFACTURERPARTNUMBER: SRF2012A-900YA; POPULATED: TRUE; ROHSCERTIFICATE: RoHS3-konform; SOURCE: DIGIKEY; SOURCEPARTNUMBER: SRF2012A-900YACT-ND
L202 = rc-sysmocom:INDUCTOR; CLASS: INDUCTOR; DESCRIPTION: FERRITE BEAD; LINK: http://www.digikey.de/product-detail/de/74279220601/732-6126-1-ND/5050862; MANUFACTURER: Wurth Electronics Inc; MANUFACTURERPARTNUMBER: 74279220601; POPULATED: TRUE; ROHSCERTIFICATE: Bleifrei / RoHS-konform; SOURCE: DIGIKEY; SOURCEPARTNUMBER: 732-6126-1-ND
LED101 = LED-PLCC2:LED: OSRAM types LY T676, LS T670 in P-LLC2 package; CLASS: LED; DESCRIPTION: LED ORANGE CLEAR 2PLCC SMD; LINK: https://www.digikey.de/product-detail/de/osram-opto-semiconductors-inc/LO-T676-S1T1-24-Z/475-2744-1-ND; MANUFACTURER: OSRAM Opto Semiconductors Inc.; MANUFACTURERPARTNUMBER: LO T676-S1T1-24-Z; POPULATED: TRUE; ROHSCERTIFICATE: RoHS3-konform; SOURCE: DIGIKEY; SOURCEPARTNUMBER: 475-2744-1-ND
LED102 LED201 LED301 = LED-PLCC2:LED: OSRAM types LY T676, LS T670 in P-LLC2 package; CLASS: LED; DESCRIPTION: LED GREEN CLEAR 2PLCC SMD; LINK: https://www.digikey.de/product-detail/de/broadcom-limited/HSME-A100-M02J1/516-2827-1-ND; MANUFACTURER: Broadcom Limited; MANUFACTURERPARTNUMBER: HSME-A100-M02J1; POPULATED: TRUE; ROHSCERTIFICATE: RoHS3-konform; SOURCE: DIGIKEY; SOURCEPARTNUMBER: 516-2827-1-ND
LED202 = led:LED: LED OSRAM: - CHIPLED LG R971, LG N971, LY N971, LG Q971, LY Q971, LO R971, LY R971 LH N974, LH R974 LS Q976, LO Q976, LY Q976 LO Q996 - Hyper CHIPLED LW Q18S LB Q993, LB Q99A, LB R99A - SideLED LS A670, LO A670, LY A670, LG A670, LP A670 LB A673, LV A673, LT A673, LW A673 LH A674 LY A675 LS A676, LA A676, LO A676, LY A676, LW A676 LS A679, LY A679, LG A679 - Hyper Micro SIDELED® LS Y876, LA Y876, LO Y876, LY Y876 LT Y87S - SmartLED LW L88C, LW L88S LB L89C, LB L89S, LG L890 LS L89K, LO L89K, LY L89K LS L896, LA L896, LO L896, LY L896 - TOPLED LS T670, LO T670, LY T670, LG T670, LP T670 LSG T670, LSP T670, LSY T670, LOP T670, LYG T670 LG T671, LOG T671, LSG T671 LB T673, LV T673, LT T673, LW T673 LH T674 LS T676, LA T676, LO T676, LY T676, LB T676, LH T676, LSB T676, LW T676 LB T67C, LV T67C, LT T67C, LS T67K, LO T67K, LY T67K, LW E67C LS E67B, LA E67B, LO E67B, LY E67B, LB E67C, LV E67C, LT E67C LW T67C LS T679, LY T679, LG T679 LS T770, LO T770, LY T770, LG T770, LP T770 LB T773, LV T773, LT T773, LW T773 LH T774 LS E675, LA E675, LY E675, LS T675 LS T776, LA T776, LO T776, LY T776, LB T776 LHGB T686 LT T68C, LB T68C - Hyper Mini TOPLED® LB M676 - Mini TOPLED Santana® LG M470 LS M47K, LO M47K, LY M47K Source: http://www.osram.convergy.de LUXEON: - LUMILED® LXK2-PW12-R00, LXK2-PW12-S00, LXK2-PW14-U00, LXK2-PW14-V00 LXK2-PM12-R00, LXK2-PM12-S00, LXK2-PM14-U00 LXK2-PE12-Q00, LXK2-PE12-R00, LXK2-PE12-S00, LXK2-PE14-T00, LXK2-PE14-U00 LXK2-PB12-K00, LXK2-PB12-L00, LXK2-PB12-M00, LXK2-PB14-N00, LXK2-PB14-P00, LXK2-PB14-Q00 LXK2-PR12-L00, LXK2-PR12-M00, LXK2-PR14-Q00, LXK2-PR14-R00 LXK2-PD12-Q00, LXK2-PD12-R00, LXK2-PD12-S00 LXK2-PH12-R00, LXK2-PH12-S00 LXK2-PL12-P00, LXK2-PL12-Q00, LXK2-PL12-R00 Source: www.luxeon.com KINGBRIGHT: KA-3528ASYC Source: www.kingbright.com; CLASS: LED; DESCRIPTION: chipLED 0603 red; LINK: UNKNOWN LINK; MANUFACTURER: KPH-1608EC; MANUFACTURERPARTNUMBER: UNKNOWN MANUFACTURER PART NUMBER; POPULATED: TRUE; ROHSCERTIFICATE: UNKNOWN ROHS CERTIFICATE; SOURCE: UNKNOWN SOURCE; SOURCEPARTNUMBER: UNKNOWN SOURCE PART NUMBER
M2 M3 = Mentor_lightpipe:MENTOR_12701001: MENTOR 1270.1001, PCB Mounted 2-Way Right Angle LED Light Pipe, Bi-Level Clear Round Lens; CLASS: LIGHT GUIDE; DESCRIPTION: NO DESCRIPTION; LINK: UNKNOWN LINK; MANUFACTURER: UNKNOWN MANUFACTURER; MANUFACTURERPARTNUMBER: UNKNOWN MANUFACTURER PART NUMBER; POPULATED: TRUE; ROHSCERTIFICATE: UNKNOWN ROHS CERTIFICATE; SOURCE: UNKNOWN SOURCE; SOURCEPARTNUMBER: UNKNOWN SOURCE PART NUMBER
NGFF101 = con-ngff:NGFF_B: m.2 / NGFF WWAN Connector; CLASS: CONNECTOR; DESCRIPTION: CONN FEMALE 67POS 0.020 GOLD; LINK: https://www.digikey.de/product-detail/de/te-connectivity-amp-connectors/2199230-3/A115903CT-ND; MANUFACTURER: TE Connectivity AMP Connectors; MANUFACTURERPARTNUMBER: 2199230-3; POPULATED: TRUE; ROHSCERTIFICATE: RoHS-konform; SOURCE: DIGIKEY; SOURCEPARTNUMBER: A115903CT-ND
Q201 = crystal:CRYSTAL: CRYSTAL; CLASS: XTAL; DESCRIPTION: CRYSTAL 12.0000MHZ 18PF SMD; LINK: https://www.digikey.de/product-detail/de/cardinal-components-inc/CSM1Z-A5B2C3-40-12-0D18/370-1108-1-ND; MANUFACTURER: Cardinal Components Inc.; MANUFACTURERPARTNUMBER: CSM1Z-A5B2C3-40-12.0D18; OC_FARNELL: unknown; OC_NEWARK: unknown; POPULATED: TRUE; ROHSCERTIFICATE: RoHS-konform; SOURCE: DIGIKEY; SOURCEPARTNUMBER: 370-1108-1-ND
R101 R102 R106 R108-R111 R115 R204 R205 R208 R211 R215-R218 R311 = rc-sysmocom:RESISTOR: Resistors 0402 - 0402 Surface Mount Package 22 Ohm 1% 1/16W [Digikey: 311-22.0LRTR-ND] 33 Ohm 5% 1/16W 1.0K 5% 1/16W 1.5K 5% 1/16W 2.0K 1% 1/16W 10.0K 1% 1/16W [Digikey: 311-10.0KLRTR-ND] 10.0K 5% 1/16W [Digikey: RMCF0402JT10K0TR-ND] 12.1K 1% 1/16W [Digikey: 311-22.0LRTR-ND] 100.0K 5% 1/16W 0603 - 0603 Surface Mount Package 1/10 Watt 0805 - 0805 Surface Mount Package 1/8 Watt 1206 - 1206 Surface Mount Package 2012 - 2010 Surface Mount Package 0.11 Ohm 1/2 Watt 1% Resistor - Digikey: RHM.11UCT-ND; CLASS: RESISTOR; DESCRIPTION: RES SMD 10K OHM 1%% 1/10W 0603; LINK: https://www.digikey.de/product-detail/de/te-connectivity-passive-product/CRG0603F10K-10/A121523CT-ND/; MANUFACTURER: TE Connectivity Passive Product; MANUFACTURERPARTNUMBER: CRG0603F10K/10; POPULATED: TRUE; ROHSCERTIFICATE: RoHS3-konform; SOURCE: DIGIKEY; SOURCEPARTNUMBER: A121523CT-ND
R103 R104 R113 = rc-sysmocom:RESISTOR: Resistors 0402 - 0402 Surface Mount Package 22 Ohm 1% 1/16W [Digikey: 311-22.0LRTR-ND] 33 Ohm 5% 1/16W 1.0K 5% 1/16W 1.5K 5% 1/16W 2.0K 1% 1/16W 10.0K 1% 1/16W [Digikey: 311-10.0KLRTR-ND] 10.0K 5% 1/16W [Digikey: RMCF0402JT10K0TR-ND] 12.1K 1% 1/16W [Digikey: 311-22.0LRTR-ND] 100.0K 5% 1/16W 0603 - 0603 Surface Mount Package 1/10 Watt 0805 - 0805 Surface Mount Package 1/8 Watt 1206 - 1206 Surface Mount Package 2012 - 2010 Surface Mount Package 0.11 Ohm 1/2 Watt 1% Resistor - Digikey: RHM.11UCT-ND; CLASS: RESISTOR; DESCRIPTION: RES SMD 4.7K OHM 5% 1/10W 0603; LINK: http://www.digikey.de/product-detail/de/RC0603JR-074K7L/311-4.7KGRCT-ND; MANUFACTURER: Yageo; MANUFACTURERPARTNUMBER: RC0603JR-074K7L; POPULATED: TRUE; ROHSCERTIFICATE: Bleifrei / RoHS-konform; SOURCE: DIGIKEY; SOURCEPARTNUMBER: 311-4.7KGRCT-ND
R105 = rc-sysmocom:RESISTOR: Resistors 0402 - 0402 Surface Mount Package 22 Ohm 1% 1/16W [Digikey: 311-22.0LRTR-ND] 33 Ohm 5% 1/16W 1.0K 5% 1/16W 1.5K 5% 1/16W 2.0K 1% 1/16W 10.0K 1% 1/16W [Digikey: 311-10.0KLRTR-ND] 10.0K 5% 1/16W [Digikey: RMCF0402JT10K0TR-ND] 12.1K 1% 1/16W [Digikey: 311-22.0LRTR-ND] 100.0K 5% 1/16W 0603 - 0603 Surface Mount Package 1/10 Watt 0805 - 0805 Surface Mount Package 1/8 Watt 1206 - 1206 Surface Mount Package 2012 - 2010 Surface Mount Package 0.11 Ohm 1/2 Watt 1% Resistor - Digikey: RHM.11UCT-ND; CLASS: RESISTOR; DESCRIPTION: RES SMD 10K OHM 1%% 1/10W 0603; LINK: https://www.digikey.de/product-detail/de/te-connectivity-passive-product/CRG0603F10K-10/A121523CT-ND/; MANUFACTURER: TE Connectivity Passive Product; MANUFACTURERPARTNUMBER: CRG0603F10K/10; POPULATED: TRUE; ROHSCERTIFICATE: RoHS-konform; SOURCE: DIGIKEY; SOURCEPARTNUMBER: A121523CT-ND
R107 R201 R203 R305 = rc-sysmocom:RESISTOR: Resistors 0402 - 0402 Surface Mount Package 22 Ohm 1% 1/16W [Digikey: 311-22.0LRTR-ND] 33 Ohm 5% 1/16W 1.0K 5% 1/16W 1.5K 5% 1/16W 2.0K 1% 1/16W 10.0K 1% 1/16W [Digikey: 311-10.0KLRTR-ND] 10.0K 5% 1/16W [Digikey: RMCF0402JT10K0TR-ND] 12.1K 1% 1/16W [Digikey: 311-22.0LRTR-ND] 100.0K 5% 1/16W 0603 - 0603 Surface Mount Package 1/10 Watt 0805 - 0805 Surface Mount Package 1/8 Watt 1206 - 1206 Surface Mount Package 2012 - 2010 Surface Mount Package 0.11 Ohm 1/2 Watt 1% Resistor - Digikey: RHM.11UCT-ND; CLASS: RESISTOR; DESCRIPTION: RES SMD 330 OHM 1%% 1/10W 0603; LINK: https://www.digikey.de/product-detail/de/yageo/RC0603FR-07330RL/311-330HRCT-ND; MANUFACTURER: Yageo; MANUFACTURERPARTNUMBER: RC0603FR-07330RL; POPULATED: TRUE; ROHSCERTIFICATE: RoHS3-konform; SOURCE: DIGIKEY; SOURCEPARTNUMBER: 311-330HRCT-ND
R112 R121 R202 R214 R219 R304 = rc-sysmocom:RESISTOR: Resistors 0402 - 0402 Surface Mount Package 22 Ohm 1% 1/16W [Digikey: 311-22.0LRTR-ND] 33 Ohm 5% 1/16W 1.0K 5% 1/16W 1.5K 5% 1/16W 2.0K 1% 1/16W 10.0K 1% 1/16W [Digikey: 311-10.0KLRTR-ND] 10.0K 5% 1/16W [Digikey: RMCF0402JT10K0TR-ND] 12.1K 1% 1/16W [Digikey: 311-22.0LRTR-ND] 100.0K 5% 1/16W 0603 - 0603 Surface Mount Package 1/10 Watt 0805 - 0805 Surface Mount Package 1/8 Watt 1206 - 1206 Surface Mount Package 2012 - 2010 Surface Mount Package 0.11 Ohm 1/2 Watt 1% Resistor - Digikey: RHM.11UCT-ND; CLASS: RESISTOR; DESCRIPTION: RES 100K OHM 1%% 1/10W 0603; LINK: https://www.digikey.de/product-detail/de/stackpole-electronics-inc/RMCF0603FT100K/RMCF0603FT100KCT-ND; MANUFACTURER: Stackpole Electronics Inc; MANUFACTURERPARTNUMBER: RMCF0603FT100K; POPULATED: TRUE; ROHSCERTIFICATE: RoHS3-konform; SOURCE: DIGIKEY; SOURCEPARTNUMBER: RMCF0603FT100KCT-ND
R114 R213 = rc-sysmocom:RESISTOR: Resistors 0402 - 0402 Surface Mount Package 22 Ohm 1% 1/16W [Digikey: 311-22.0LRTR-ND] 33 Ohm 5% 1/16W 1.0K 5% 1/16W 1.5K 5% 1/16W 2.0K 1% 1/16W 10.0K 1% 1/16W [Digikey: 311-10.0KLRTR-ND] 10.0K 5% 1/16W [Digikey: RMCF0402JT10K0TR-ND] 12.1K 1% 1/16W [Digikey: 311-22.0LRTR-ND] 100.0K 5% 1/16W 0603 - 0603 Surface Mount Package 1/10 Watt 0805 - 0805 Surface Mount Package 1/8 Watt 1206 - 1206 Surface Mount Package 2012 - 2010 Surface Mount Package 0.11 Ohm 1/2 Watt 1% Resistor - Digikey: RHM.11UCT-ND; CLASS: RESISTOR; DESCRIPTION: RES 47K OHM 1%% 1/10W 0603; LINK: https://www.digikey.de/product-detail/de/stackpole-electronics-inc/RMCF0603FT47K0/RMCF0603FT47K0CT-ND; MANUFACTURER: Stackpole Electronics Inc; MANUFACTURERPARTNUMBER: RMCF0603FT47K0; POPULATED: TRUE; ROHSCERTIFICATE: Bleifrei / RoHS-konform; SOURCE: DIGIKEY; SOURCEPARTNUMBER: RMCF0603FT47K0CT-ND
R117-R119 R210 = rc-sysmocom:RESISTOR: Resistors 0402 - 0402 Surface Mount Package 22 Ohm 1% 1/16W [Digikey: 311-22.0LRTR-ND] 33 Ohm 5% 1/16W 1.0K 5% 1/16W 1.5K 5% 1/16W 2.0K 1% 1/16W 10.0K 1% 1/16W [Digikey: 311-10.0KLRTR-ND] 10.0K 5% 1/16W [Digikey: RMCF0402JT10K0TR-ND] 12.1K 1% 1/16W [Digikey: 311-22.0LRTR-ND] 100.0K 5% 1/16W 0603 - 0603 Surface Mount Package 1/10 Watt 0805 - 0805 Surface Mount Package 1/8 Watt 1206 - 1206 Surface Mount Package 2012 - 2010 Surface Mount Package 0.11 Ohm 1/2 Watt 1% Resistor - Digikey: RHM.11UCT-ND; CLASS: RESISTOR; DESCRIPTION: RES SMD 47R 0402 1%; LINK: https://www.digikey.de/product-detail/de/te-connectivity-passive-product/CRGCQ0402F47R/A129611CT-ND; MANUFACTURER: TE Connectivity Passive Product; MANUFACTURERPARTNUMBER: CRGCQ0402F47R; POPULATED: TRUE; ROHSCERTIFICATE: Bleifrei / RoHS-konform; SOURCE: DIGIKEY; SOURCEPARTNUMBER: A129611CT-ND
R120 = rc-sysmocom:RESISTOR: Resistors 0402 - 0402 Surface Mount Package 22 Ohm 1% 1/16W [Digikey: 311-22.0LRTR-ND] 33 Ohm 5% 1/16W 1.0K 5% 1/16W 1.5K 5% 1/16W 2.0K 1% 1/16W 10.0K 1% 1/16W [Digikey: 311-10.0KLRTR-ND] 10.0K 5% 1/16W [Digikey: RMCF0402JT10K0TR-ND] 12.1K 1% 1/16W [Digikey: 311-22.0LRTR-ND] 100.0K 5% 1/16W 0603 - 0603 Surface Mount Package 1/10 Watt 0805 - 0805 Surface Mount Package 1/8 Watt 1206 - 1206 Surface Mount Package 2012 - 2010 Surface Mount Package 0.11 Ohm 1/2 Watt 1% Resistor - Digikey: RHM.11UCT-ND; CLASS: RESISTOR; DESCRIPTION: RES 510 OHM 1%% 1/10W 0603; LINK: https://www.digikey.de/product-detail/de/stackpole-electronics-inc/RMCF0603FT510R/RMCF0603FT510RCT-ND; MANUFACTURER: Stackpole Electronics Inc; MANUFACTURERPARTNUMBER: RMCF0603FT510R; POPULATED: TRUE; ROHSCERTIFICATE: RoHS3-konform; SOURCE: DIGIKEY; SOURCEPARTNUMBER: RMCF0603FT510RCT-ND
R206 R207 = rc-sysmocom:RESISTOR: Resistors 0402 - 0402 Surface Mount Package 22 Ohm 1% 1/16W [Digikey: 311-22.0LRTR-ND] 33 Ohm 5% 1/16W 1.0K 5% 1/16W 1.5K 5% 1/16W 2.0K 1% 1/16W 10.0K 1% 1/16W [Digikey: 311-10.0KLRTR-ND] 10.0K 5% 1/16W [Digikey: RMCF0402JT10K0TR-ND] 12.1K 1% 1/16W [Digikey: 311-22.0LRTR-ND] 100.0K 5% 1/16W 0603 - 0603 Surface Mount Package 1/10 Watt 0805 - 0805 Surface Mount Package 1/8 Watt 1206 - 1206 Surface Mount Package 2012 - 2010 Surface Mount Package 0.11 Ohm 1/2 Watt 1% Resistor - Digikey: RHM.11UCT-ND; CLASS: RESISTOR; DESCRIPTION: RES SMD 27 OHM 5% 1/10W 0603; LINK: http://www.digikey.de/product-detail/de/RC0603JR-0727RL/311-27GRCT-ND/729698; MANUFACTURER: Yageo; MANUFACTURERPARTNUMBER: RC0603JR-0727RL; POPULATED: TRUE; ROHSCERTIFICATE: Bleifrei / RoHS-konform; SOURCE: DIGIKEY; SOURCEPARTNUMBER: 311-27GRCT-ND
R209 = rc-sysmocom:RESISTOR: Resistors 0402 - 0402 Surface Mount Package 22 Ohm 1% 1/16W [Digikey: 311-22.0LRTR-ND] 33 Ohm 5% 1/16W 1.0K 5% 1/16W 1.5K 5% 1/16W 2.0K 1% 1/16W 10.0K 1% 1/16W [Digikey: 311-10.0KLRTR-ND] 10.0K 5% 1/16W [Digikey: RMCF0402JT10K0TR-ND] 12.1K 1% 1/16W [Digikey: 311-22.0LRTR-ND] 100.0K 5% 1/16W 0603 - 0603 Surface Mount Package 1/10 Watt 0805 - 0805 Surface Mount Package 1/8 Watt 1206 - 1206 Surface Mount Package 2012 - 2010 Surface Mount Package 0.11 Ohm 1/2 Watt 1% Resistor - Digikey: RHM.11UCT-ND; CLASS: RESISTOR; DESCRIPTION: CRGCQ 0603 1K5 1%%; LINK: https://www.digikey.de/product-detail/de/te-connectivity-passive-product/CRGCQ0603F1K5/A129690CT-ND/; MANUFACTURER: TE Connectivity Passive Product; MANUFACTURERPARTNUMBER: CRGCQ0603F1K5; POPULATED: TRUE; ROHSCERTIFICATE: RoHS-konform; SOURCE: DIGIKEY; SOURCEPARTNUMBER: A129690CT-ND
R212 = rc-sysmocom:RESISTOR: Resistors 0402 - 0402 Surface Mount Package 22 Ohm 1% 1/16W [Digikey: 311-22.0LRTR-ND] 33 Ohm 5% 1/16W 1.0K 5% 1/16W 1.5K 5% 1/16W 2.0K 1% 1/16W 10.0K 1% 1/16W [Digikey: 311-10.0KLRTR-ND] 10.0K 5% 1/16W [Digikey: RMCF0402JT10K0TR-ND] 12.1K 1% 1/16W [Digikey: 311-22.0LRTR-ND] 100.0K 5% 1/16W 0603 - 0603 Surface Mount Package 1/10 Watt 0805 - 0805 Surface Mount Package 1/8 Watt 1206 - 1206 Surface Mount Package 2012 - 2010 Surface Mount Package 0.11 Ohm 1/2 Watt 1% Resistor - Digikey: RHM.11UCT-ND; CLASS: RESISTOR; DESCRIPTION: RES SMD 30K OHM 1%% 1/10W 0603; LINK: https://www.digikey.de/product-detail/de/yageo/RC0603FR-0730KL/311-30-0KHRCT-ND/730087; MANUFACTURER: Yageo; MANUFACTURERPARTNUMBER: RC0603FR-0730KL; POPULATED: TRUE; ROHSCERTIFICATE: RoHS3-konform; SOURCE: DIGIKEY; SOURCEPARTNUMBER: 311-30.0KHRCT-ND
R220 R221 R303 R306 R309 R310 = rc-sysmocom:RESISTOR: Resistors 0402 - 0402 Surface Mount Package 22 Ohm 1% 1/16W [Digikey: 311-22.0LRTR-ND] 33 Ohm 5% 1/16W 1.0K 5% 1/16W 1.5K 5% 1/16W 2.0K 1% 1/16W 10.0K 1% 1/16W [Digikey: 311-10.0KLRTR-ND] 10.0K 5% 1/16W [Digikey: RMCF0402JT10K0TR-ND] 12.1K 1% 1/16W [Digikey: 311-22.0LRTR-ND] 100.0K 5% 1/16W 0603 - 0603 Surface Mount Package 1/10 Watt 0805 - 0805 Surface Mount Package 1/8 Watt 1206 - 1206 Surface Mount Package 2012 - 2010 Surface Mount Package 0.11 Ohm 1/2 Watt 1% Resistor - Digikey: RHM.11UCT-ND; CLASS: RESISTOR; DESCRIPTION: NO DESCRIPTION; LINK: UNKNOWN LINK; MANUFACTURER: UNKNOWN MANUFACTURER; MANUFACTURERPARTNUMBER: UNKNOWN MANUFACTURER PART NUMBER; POPULATED: FALSE; ROHSCERTIFICATE: UNKNOWN ROHS CERTIFICATE; SOURCE: UNKNOWN SOURCE; SOURCEPARTNUMBER: UNKNOWN SOURCE PART NUMBER
R301 = rc-sysmocom:RESISTOR: Resistors 0402 - 0402 Surface Mount Package 22 Ohm 1% 1/16W [Digikey: 311-22.0LRTR-ND] 33 Ohm 5% 1/16W 1.0K 5% 1/16W 1.5K 5% 1/16W 2.0K 1% 1/16W 10.0K 1% 1/16W [Digikey: 311-10.0KLRTR-ND] 10.0K 5% 1/16W [Digikey: RMCF0402JT10K0TR-ND] 12.1K 1% 1/16W [Digikey: 311-22.0LRTR-ND] 100.0K 5% 1/16W 0603 - 0603 Surface Mount Package 1/10 Watt 0805 - 0805 Surface Mount Package 1/8 Watt 1206 - 1206 Surface Mount Package 2012 - 2010 Surface Mount Package 0.11 Ohm 1/2 Watt 1% Resistor - Digikey: RHM.11UCT-ND; CLASS: RESISTOR; DESCRIPTION: RES 0 OHM JUMPER 1206; LINK: https://www.digikey.de/product-detail/de/koa-speer-electronics-inc/TLRZ2BTTD/2019-TLRZ2BTTDCT-ND; MANUFACTURER: KOA Speer Electronics, Inc.; MANUFACTURERPARTNUMBER: TLRZ2BTTD; POPULATED: TRUE; ROHSCERTIFICATE: RoHS3-konform; SOURCE: DIGIKEY; SOURCEPARTNUMBER: 2019-TLRZ2BTTDCT-ND
R302 = rc-sysmocom:RESISTOR: Resistors 0402 - 0402 Surface Mount Package 22 Ohm 1% 1/16W [Digikey: 311-22.0LRTR-ND] 33 Ohm 5% 1/16W 1.0K 5% 1/16W 1.5K 5% 1/16W 2.0K 1% 1/16W 10.0K 1% 1/16W [Digikey: 311-10.0KLRTR-ND] 10.0K 5% 1/16W [Digikey: RMCF0402JT10K0TR-ND] 12.1K 1% 1/16W [Digikey: 311-22.0LRTR-ND] 100.0K 5% 1/16W 0603 - 0603 Surface Mount Package 1/10 Watt 0805 - 0805 Surface Mount Package 1/8 Watt 1206 - 1206 Surface Mount Package 2012 - 2010 Surface Mount Package 0.11 Ohm 1/2 Watt 1% Resistor - Digikey: RHM.11UCT-ND; CLASS: RESISTOR; DESCRIPTION: RES 0 OHM JUMPER 1206; LINK: https://www.digikey.de/product-detail/de/koa-speer-electronics-inc/TLRZ2BTTD/2019-TLRZ2BTTDCT-ND; MANUFACTURER: KOA Speer Electronics, Inc.; MANUFACTURERPARTNUMBER: TLRZ2BTTD; POPULATED: FALSE; ROHSCERTIFICATE: RoHS3-konform; SOURCE: DIGIKEY; SOURCEPARTNUMBER: 2019-TLRZ2BTTDCT-ND
R307 = rc-sysmocom:RESISTOR: Resistors 0402 - 0402 Surface Mount Package 22 Ohm 1% 1/16W [Digikey: 311-22.0LRTR-ND] 33 Ohm 5% 1/16W 1.0K 5% 1/16W 1.5K 5% 1/16W 2.0K 1% 1/16W 10.0K 1% 1/16W [Digikey: 311-10.0KLRTR-ND] 10.0K 5% 1/16W [Digikey: RMCF0402JT10K0TR-ND] 12.1K 1% 1/16W [Digikey: 311-22.0LRTR-ND] 100.0K 5% 1/16W 0603 - 0603 Surface Mount Package 1/10 Watt 0805 - 0805 Surface Mount Package 1/8 Watt 1206 - 1206 Surface Mount Package 2012 - 2010 Surface Mount Package 0.11 Ohm 1/2 Watt 1% Resistor - Digikey: RHM.11UCT-ND; CLASS: RESISTOR; DESCRIPTION: RES SMD 2K OHM 1% 1/10W 0603; LINK: https://www.digikey.de/product-detail/de/yageo/RC0603FR-072KL/311-2-00KHRCT-ND/729956; MANUFACTURER: YAGEO; MANUFACTURERPARTNUMBER: RC0603FR-072KL; POPULATED: TRUE; ROHSCERTIFICATE: RoHS3-konform; SOURCE: DIGIKEY; SOURCEPARTNUMBER: 311-2.00KHRCT-ND
R308 = rc-sysmocom:RESISTOR: Resistors 0402 - 0402 Surface Mount Package 22 Ohm 1% 1/16W [Digikey: 311-22.0LRTR-ND] 33 Ohm 5% 1/16W 1.0K 5% 1/16W 1.5K 5% 1/16W 2.0K 1% 1/16W 10.0K 1% 1/16W [Digikey: 311-10.0KLRTR-ND] 10.0K 5% 1/16W [Digikey: RMCF0402JT10K0TR-ND] 12.1K 1% 1/16W [Digikey: 311-22.0LRTR-ND] 100.0K 5% 1/16W 0603 - 0603 Surface Mount Package 1/10 Watt 0805 - 0805 Surface Mount Package 1/8 Watt 1206 - 1206 Surface Mount Package 2012 - 2010 Surface Mount Package 0.11 Ohm 1/2 Watt 1% Resistor - Digikey: RHM.11UCT-ND; CLASS: RESISTOR; DESCRIPTION: RES SMD 180R 1% 1/10W 0603; LINK: https://www.digikey.de/product-detail/de/te-connectivity-passive-product/CRGCQ0603F180R/A129679CT-ND/; MANUFACTURER: TE Connectivity Passive Product; MANUFACTURERPARTNUMBER: CRGCQ0603F180R; POPULATED: TRUE; ROHSCERTIFICATE: RoHS3-konform; SOURCE: DIGIKEY; SOURCEPARTNUMBER: A129679CT-ND
SH301 = shorts:SHORT-H: Short between two nets; BOM: no; CLASS: UNKNOWN CLASS; DESCRIPTION: NO DESCRIPTION; LINK: UNKNOWN LINK; MANUFACTURER: UNKNOWN MANUFACTURER; MANUFACTURERPARTNUMBER: UNKNOWN MANUFACTURER PART NUMBER; POPULATED: FALSE; ROHSCERTIFICATE: UNKNOWN ROHS CERTIFICATE; SOURCE: UNKNOWN SOURCE; SOURCEPARTNUMBER: UNKNOWN SOURCE PART NUMBER
SIM101 = SIM-Molex:MOLEX-475530001: Molex 0475530001 http://www.molex.com/pdm_docs/sd/475530001_sd.pdf; CLASS: SIM HOLDER; DESCRIPTION: CONN SIM CARD PUSH-PUSH R/A SMD; LINK: https://www.digikey.de/product-detail/de/molex/0475530001/WM3293TR-ND/2404889; MANUFACTURER: Molex; MANUFACTURERPARTNUMBER: 0475530001; POPULATED: TRUE; ROHSCERTIFICATE: RoHS3-konform; SOURCE: DIGIKEY; SOURCEPARTNUMBER: WM3293TR-ND
T101 T102 = transistor:*-NPN-: NPN Transistror BF959 corrected 2008.03.06; CLASS: TRANSISTOR; DESCRIPTION: TRANS NPN 45V 100MA TO236AB; LINK: https://www.digikey.de/product-detail/de/nexperia-usa-inc/BC850C-235/1727-6194-1-ND/; MANUFACTURER: Nexperia USA Inc.; MANUFACTURERPARTNUMBER: BC850C,235; POPULATED: TRUE; ROHSCERTIFICATE: RoHS3-konform; SOURCE: DIGIKEY; SOURCEPARTNUMBER: 1727-6194-1-ND
TC201 = tag-connect:TC2050-IDC: Tag-Connect In Circuit Programming & Debug Cable 10 Pin http://www.tag-connect.com; CLASS: FOOTPRINT; DESCRIPTION: TAG-CONNECT footprint; LINK: UNKNOWN LINK; MANUFACTURER: TAG-CONNECT; MANUFACTURERPARTNUMBER: TC-2050; POPULATED: FALSE; ROHSCERTIFICATE: UNKNOWN ROHS CERTIFICATE; SOURCE: UNKNOWN SOURCE; SOURCEPARTNUMBER: UNKNOWN SOURCE PART NUMBER
TP1 TP2 = testpad:TP: Test pad; CLASS: TEST POINT; DESCRIPTION: NO DESCRIPTION; LINK: UNKNOWN LINK; MANUFACTURER: UNKNOWN MANUFACTURER; MANUFACTURERPARTNUMBER: UNKNOWN MANUFACTURER PART NUMBER; POPULATED: TRUE; ROHSCERTIFICATE: UNKNOWN ROHS CERTIFICATE; SOURCE: UNKNOWN SOURCE; SOURCEPARTNUMBER: UNKNOWN SOURCE PART NUMBER
U201 = laforge:IP4234CZ6: NXP IP4234CZ6 - Single USB 2.0 ESD protection to IEC 61000-4-2 level 4; CLASS: IC; DESCRIPTION: TVS DIODE 5.5VWM 6TSOP; LINK: https://www.digikey.de/product-detail/de/nexperia-usa-inc/IP4234CZ6115/1727-1217-1-ND; MANUFACTURER: Nexperia USA Inc.; MANUFACTURERPARTNUMBER: IP4234CZ6,115; OC_DIGIKEY: 568-5869-1-ND; POPULATED: TRUE; ROHSCERTIFICATE: RoHS3-konform; SOURCE: DIGIKEY; SOURCEPARTNUMBER: 1727-1217-1-ND
U202 = atmel-arm:AT91SAM3S: ATMEL AT91SAM3S, LQFP-64; CLASS: IC; DESCRIPTION: IC MCU 32BIT 256KB FLASH 64LQFP; LINK: http://www.digikey.de/product-detail/de/ATSAM3S4BA-AU/ATSAM3S4BA-AU-ND; MANUFACTURER: Atmel; MANUFACTURERPARTNUMBER: ATSAM3S4BA-AU; POPULATED: TRUE; ROHSCERTIFICATE: Bleifrei / RoHS-konform; SOURCE: DIGIKEY; SOURCEPARTNUMBER: ATSAM3S4BA-AU-ND
U301 = ldo:LDO_FIXED_EN: High-Performance Single 150mA LDO; CLASS: IC; DESCRIPTION: IC REG LINEAR 1.8V 150MA SC70-5; LINK: https://www.digikey.de/product-detail/de/microchip-technology/MIC5366-1.8YC5-TR/576-3203-1-ND; MANUFACTURER: Microchip Technology; MANUFACTURERPARTNUMBER: MIC5366-1.8YC5-TR; POPULATED: TRUE; ROHSCERTIFICATE: Bleifrei / RoHS3-konform; SOURCE: DIGIKEY; SOURCEPARTNUMBER: 576-3203-1-ND
X101 X103 = SparkFun-Connectors:PINHD-2X3: PIN HEADER; CLASS: CONNECTOR; DESCRIPTION: PIN HEADER, THR, DUAL ROW, .100"; LINK: https://www.digikey.de/product-detail/de/metz-connect-usa-inc/PR20203VBDN/1849-PR20203VBDN-ND; MANUFACTURER: METZ CONNECT USA Inc.; MANUFACTURERPARTNUMBER: PR20203VBDN; POPULATED: TRUE; ROHSCERTIFICATE: RoHS3-konform; SOURCE: DIGIKEY; SOURCEPARTNUMBER: 1849-PR20203VBDN-ND
X102 = USB30-MICROB:USB3.0-MICROB; CLASS: CONNECTOR; DESCRIPTION: CONN RCPT USB3.0 MICRO B SMD R/A; LINK: https://www.digikey.de/product-detail/de/hirose-electric-co-ltd/ZX360D-B-10P-30/H125269DKR-ND; MANUFACTURER: Hirose Electric Co Ltd; MANUFACTURERPARTNUMBER: ZX360D-B-10P(30); POPULATED: TRUE; ROHSCERTIFICATE: Bleifrei / RoHS-konform; SOURCE: DIGIKEY; SOURCEPARTNUMBER: H125269DKR-ND
X201 = con-hirose:MINI-USB-SHIELD-: MINI USB Connector Source: http://www.hirose.co.jp/cataloge_hp/e24000019.pdf; CLASS: CONNECTOR; LINK: http://www.digikey.com/product-detail/en/hirose-electric-co-ltd/UX60-MB-5ST/H2959CT-ND/597538; POPULATED: TRUE; SOURCE: DIGIKEY
X202 = laforge:PINHD-1X3: Header 3 Standard 3-pin 0.1" header; CLASS: CONNECTOR; DESCRIPTION: NO DESCRIPTION; LINK: UNKNOWN LINK; MANUFACTURER: UNKNOWN MANUFACTURER; MANUFACTURERPARTNUMBER: UNKNOWN MANUFACTURER PART NUMBER; POPULATED: TRUE; ROHSCERTIFICATE: UNKNOWN ROHS CERTIFICATE; SOURCE: UNKNOWN SOURCE; SOURCEPARTNUMBER: UNKNOWN SOURCE PART NUMBER
X203 = laforge:JACK2.5_SJ-2523: CUI Inc. SJ-2523-SMT; CLASS: CONNECTOR; DESCRIPTION: CONN JACK STEREO 2.5MM SMD R/A; LINK: https://www.digikey.de/product-detail/de/cui-inc/SJ-2523-SMT-TR/CP-2523SJCT-ND/669702; MANUFACTURER: CUI Inc.; MANUFACTURERPARTNUMBER: SJ-2523-SMT-TR; POPULATED: TRUE; ROHSCERTIFICATE: Bleifrei / RoHS-konform; SOURCE: DIGIKEY; SOURCEPARTNUMBER: CP-2523SJCT-ND
X301 = 171826-4:171826-4: 171826-4; CLASS: CONNECTOR; DESCRIPTION: CONN HEADER R/A 4POS 2.5MM; LINK: https://www.digikey.de/product-detail/de/171826-4/A112643-ND; MANUFACTURER: TE Connectivity AMP Connectors; MANUFACTURERPARTNUMBER: 171826-4; POPULATED: TRUE; ROHSCERTIFICATE: RoHS-konform; SOURCE: DIGIKEY; SOURCEPARTNUMBER: A112643-ND

## Net classes
0 default: clearance 0.25 mm
1 usb: width 0.185 mm, clearance 0.195 mm
2 supply: width 0.6 mm, clearance 0.3 mm
3 supply-poly: width 0.6 mm, clearance 0.3 mm to class 0, clearance 0.3 mm